# Altium project COB with RK3399.PrjPcb (part 1 of 5)
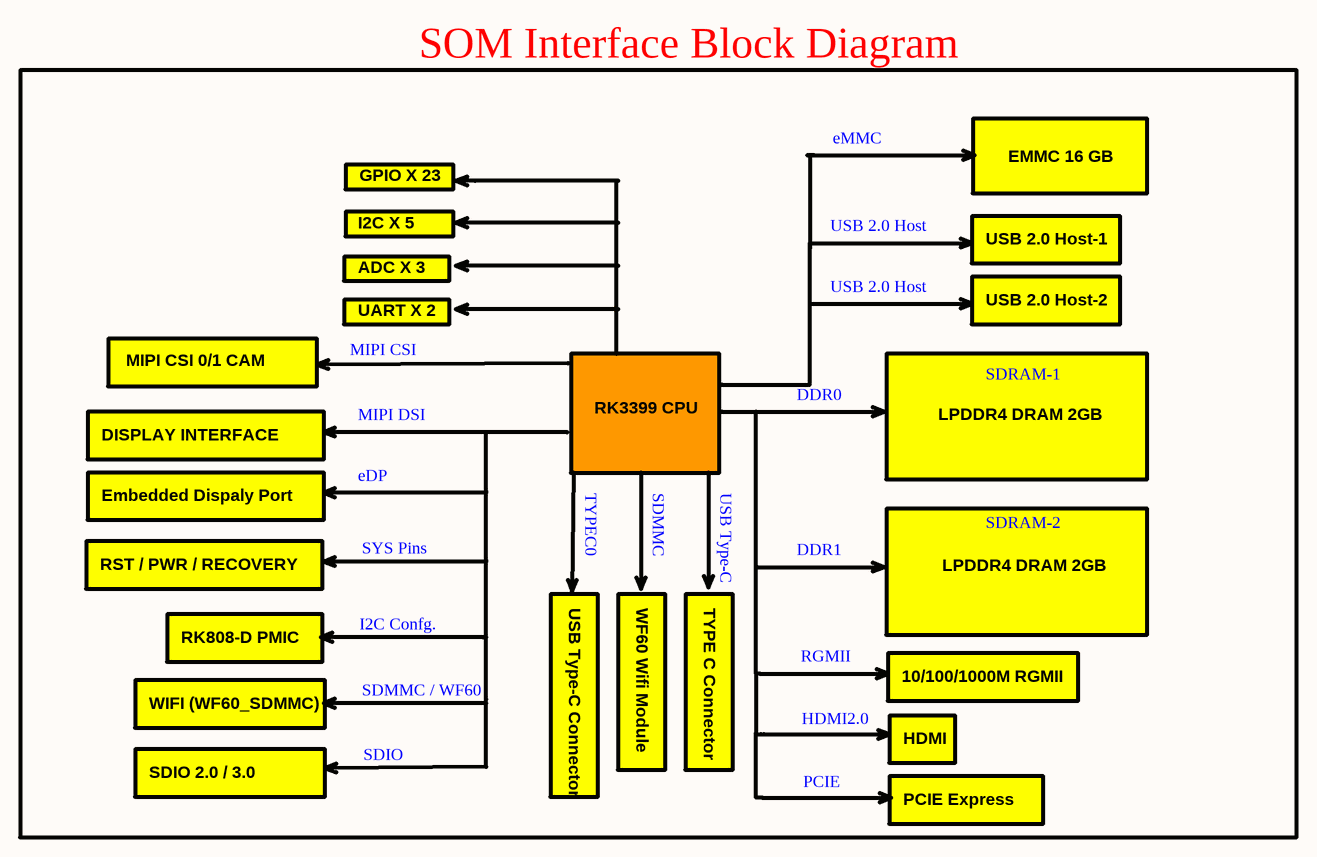
[diagram p0: Block Representation of COB.SchDoc]
27 sheets, 719 parts. Net scope: global (net labels, ports and power ports of the same name join across sheets).
Board file: COB with RK3399.PcbDoc
Sheets:
  Block Representation of COB.SchDoc
  Power Supply Page for RK3399.SchDoc
  System PMU for RK3399.SchDoc
  RK3399 Side of LPDDR4 Controller.SchDoc
  LPDDR4 SDRAM_1.SchDoc
  LPDDR4 SDRAM_2.SchDoc
  SDMMC EMMC PCIE ADC Blocks.SchDoc
  HDMI_MIPI-DSI_EDP.SchDoc
  TYPEC_USB2.0.SchDoc
  I2C_GPIOs_MIPI-CSI.SchDoc
  RGMII_SDIO_I2S.SchDoc
  PMIC_Block.SchDoc
  EMMC with RK3399.SchDoc
  WIFI Module Page.SchDoc
  Regulators and Buck Converters.SchDoc
  Power Supply for CPU Blocks.SchDoc
  RGMII ETH PHY.SchDoc
  RJ45 Connector and ESD Diodes.SchDoc
  HDMI Connector for RK3399.SchDoc
  TYPEC0 Connector.SchDoc
  USB2.0 Host Connectors.SchDoc
  MIPI CSI 0 and 1 Connectors.SchDoc
  EDP and MIPI DSI Connectors.SchDoc
  CODEC and Headphone Jack.SchDoc
  SD Card and Debug Uart.SchDoc
  40 Pin BS, FAN Connector and Test LEDs.SchDoc
  PCIE Connector.SchDoc

## Sheet Block Representation of COB.SchDoc: RK3399 COB Design V1.0
size A3; Author: AVIRAL MISHRA; DocumentNumber: 1; SheetNumber: 1; SheetTotal: 27; PROJECT CODE: A_V1.0

### Notes on the sheet
- SOM Interface Block Diagram
- eMMC
- EMMC 16 GB
- I2C X 5
- GPIO X 23
- USB 2.0 Host
- ADC X 3
- USB 2.0 Host-1
- MIPI CSI 0/1 CAM
- MIPI CSI
- UART X 2
- USB 2.0 Host-2
- MIPI DSI
- RK3399 CPU
- DDR0
- LPDDR4 DRAM 2GB
- SDRAM-1
- DISPLAY INTERFACE
- Embedded Dispaly Port
- eDP
- TYPEC0
- SDMMC
- USB Type-C
- SYS Pins
- DDR1
- SDRAM-2
- RST / PWR / RECOVERY
- I2C Confg.
- USB Type-C Connector
- WF60 Wifi Module
- TYPE C Connector
- RK808-D PMIC
- SDMMC / WF60
- RGMII
- 10/100/1000M RGMII
- WIFI (WF60_SDMMC)
- SDIO
- HDMI2.0
- HDMI
- SDIO 2.0 / 3.0
- PCIE
- PCIE Express
- TITLE:
- DOCUMENT NAME:
- SCALE 1:1
- This document is copyright of EsteemPCB and shall not be revealed, produced, copied, in whole or in part, nor
- PROJECT CODE:
- TEMPLATE:
- A4
- AUTHOR:
- Sheet
- of
- used for any purpose other than submitted.

## Sheet Power Supply Page for RK3399.SchDoc: RK3399 COB Design V1.0
size A3; Author: ABC; Organization: Altium Limited; Address1: L3, 12a Rodborough Rd; Address2: Frenchs Forest; Address3: NSW; Address4: Australia 2086; DocumentNumber: 2; SheetNumber: 2; SheetTotal: 27; PROJECT CODE: A_V1.0
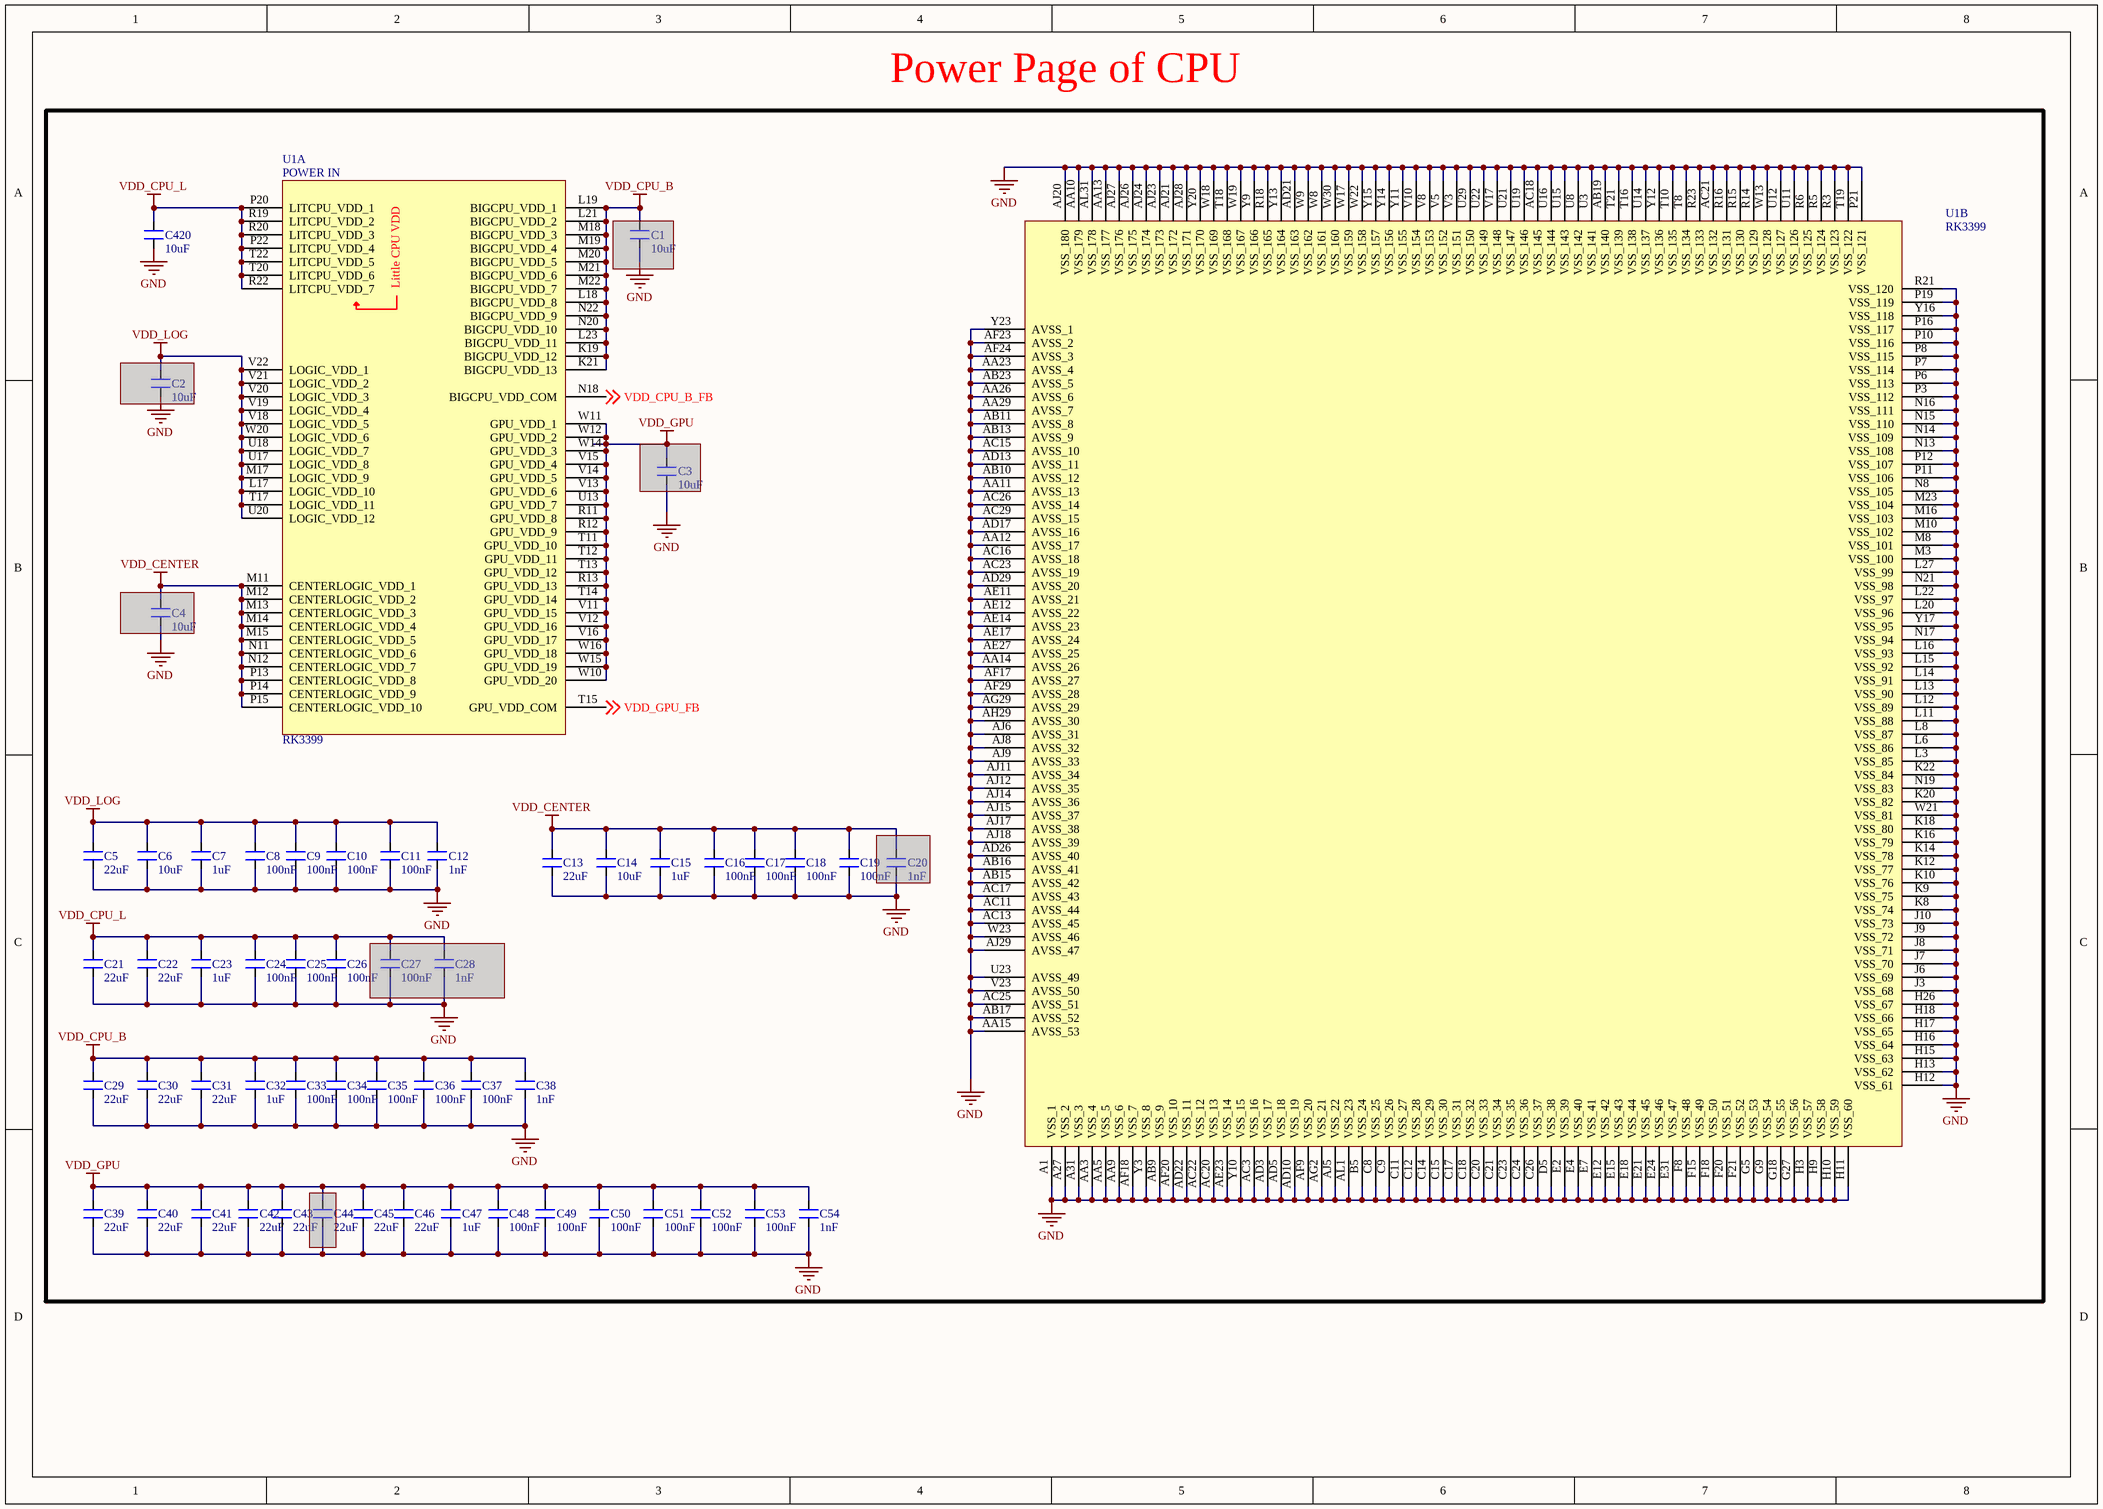
[diagram p1: Power Supply Page for RK3399.SchDoc]

### Parts
C1  10uF  [CAP_0402]  (masked out: inside a compile mask, not in the netlist)
C2  10uF  [CAP_0402]  (masked out: inside a compile mask, not in the netlist)
C3  10uF  [CAP_0402]  (masked out: inside a compile mask, not in the netlist)
C4  10uF  [CAP_0402]  (masked out: inside a compile mask, not in the netlist)
C5  22uF  [CAP_0402]
C6  10uF  [CAP_0402]
C7  1uF  [CAP_0201]
C8  100nF  [CAP_0201]
C9  100nF  [CAP_0201]
C10  100nF  [CAP_0201]
C11  100nF  [CAP_0201]
C12  1nF  [CAP_0201]
C13  22uF  [CAP_0402]
C14  10uF  [CAP_0402]
C15  1uF  [CAP_0201]
C16  100nF  [CAP_0201]
C17  100nF  [CAP_0201]
C18  100nF  [CAP_0201]
C19  100nF  [CAP_0201]
C20  1nF  [CAP_0201]  (masked out: inside a compile mask, not in the netlist)
C21  22uF  [CAP_0402]
C22  22uF  [CAP_0402]
C23  1uF  [CAP_0201]
C24  100nF  [CAP_0201]
C25  100nF  [CAP_0201]
C26  100nF  [CAP_0201]
C27  100nF  [CAP_0201]  (masked out: inside a compile mask, not in the netlist)
C28  1nF  [CAP_0201]  (masked out: inside a compile mask, not in the netlist)
C29  22uF  [CAP_0402]
C30  22uF  [CAP_0402]
C31  22uF  [CAP_0402]
C32  1uF  [CAP_0201]
C33  100nF  [CAP_0201]
C34  100nF  [CAP_0201]
C35  100nF  [CAP_0201]
C36  100nF  [CAP_0201]
C37  100nF  [CAP_0201]
C38  1nF  [CAP_0201]
C39  22uF  [CAP_0402]
C40  22uF  [CAP_0402]
C41  22uF  [CAP_0402]
C42  22uF  [CAP_0402]
C43  22uF  [CAP_0402]
C44  22uF  [CAP_0402]  (masked out: inside a compile mask, not in the netlist)
C45  22uF  [CAP_0402]
C46  22uF  [CAP_0402]
C47  1uF  [CAP_0201]
C48  100nF  [CAP_0201]
C49  100nF  [CAP_0201]
C50  100nF  [CAP_0201]
C51  100nF  [CAP_0201]
C52  100nF  [CAP_0201]
C53  100nF  [CAP_0201]
C54  1nF  [CAP_0201]
C420  10uF  [CAP_0402]
U1  RK3399  [FBGA828_23_826X826]  (parts A,B of 24)

### Blocks framed on the sheet
Power Page of CPU: C1-C54 C420 U1

### Nets
GND: C5.1 C6.1 C7.1 C8.1 C9.1 C10.1 C11.1 C12.1 C13.1 C14.1 C15.1 C16.1 C17.1 C18.1 C19.1 C21.1 C22.1 C23.1 C24.1 C25.1 C26.1 C29.1 C30.1 C31.1 C32.1 C33.1 C34.1 C35.1 C36.1 C37.1 C38.1 C39.1 C40.1 C41.1 C42.1 C43.1 C45.1 C46.1 C47.1 C48.1 C49.1 C50.1 C51.1 C52.1 C53.1 C54.1 C420.1 U1.A1(VSS_1) U1.A27(VSS_2) U1.A31(VSS_3) U1.AA3(VSS_4) U1.AA5(VSS_5) U1.AA9(VSS_6) U1.AA10(VSS_179) U1.AA11(AVSS_13) U1.AA12(AVSS_17) U1.AA13(VSS_177) U1.AA14(AVSS_26) U1.AA15(AVSS_53) U1.AA23(AVSS_4) U1.AA26(AVSS_6) U1.AA29(AVSS_7) U1.AB9(VSS_9) U1.AB10(AVSS_12) U1.AB11(AVSS_8) U1.AB13(AVSS_9) U1.AB15(AVSS_42) U1.AB16(AVSS_41) U1.AB17(AVSS_52) U1.AB19(VSS_140) U1.AB23(AVSS_5) U1.AC3(VSS_16) U1.AC11(AVSS_44) U1.AC13(AVSS_45) U1.AC15(AVSS_10) U1.AC16(AVSS_18) U1.AC17(AVSS_43) U1.AC18(VSS_145) U1.AC20(VSS_13) U1.AC21(VSS_132) U1.AC22(VSS_12) U1.AC23(AVSS_19) U1.AC25(AVSS_51) U1.AC26(AVSS_14) U1.AC29(AVSS_15) U1.AD3(VSS_17) U1.AD5(VSS_18) U1.AD10(VSS_19) U1.AD13(AVSS_11) U1.AD17(AVSS_16) U1.AD21(VSS_163) U1.AD22(VSS_11) U1.AD26(AVSS_40) U1.AD29(AVSS_20) U1.AE11(AVSS_21) U1.AE12(AVSS_22) U1.AE14(AVSS_23) U1.AE17(AVSS_24) U1.AE23(VSS_14) U1.AE27(AVSS_25) U1.AF9(VSS_20) U1.AF17(AVSS_27) U1.AF18(VSS_7) U1.AF20(VSS_10) U1.AF23(AVSS_2) U1.AF24(AVSS_3) U1.AF29(AVSS_28) U1.AG2(VSS_21) U1.AG29(AVSS_29) U1.AH29(AVSS_30) U1.AJ5(VSS_22) U1.AJ6(AVSS_31) U1.AJ8(AVSS_32) U1.AJ9(AVSS_33) U1.AJ11(AVSS_34) U1.AJ12(AVSS_35) U1.AJ14(AVSS_36) U1.AJ15(AVSS_37) U1.AJ17(AVSS_38) U1.AJ18(AVSS_39) U1.AJ20(VSS_180) U1.AJ21(VSS_172) U1.AJ23(VSS_173) U1.AJ24(VSS_174) U1.AJ26(VSS_175) U1.AJ27(VSS_176) U1.AJ28(VSS_171) U1.AJ29(AVSS_47) U1.AL1(VSS_23) U1.AL31(VSS_178) U1.B5(VSS_24) U1.C8(VSS_25) U1.C9(VSS_26) U1.C11(VSS_27) U1.C12(VSS_28) U1.C14(VSS_29) U1.C15(VSS_30) U1.C17(VSS_31) U1.C18(VSS_32) U1.C20(VSS_33) U1.C21(VSS_34) U1.C23(VSS_35) U1.C24(VSS_36) U1.C26(VSS_37) U1.D5(VSS_38) U1.E2(VSS_39) U1.E4(VSS_40) U1.E7(VSS_41) U1.E12(VSS_42) U1.E15(VSS_43) U1.E18(VSS_44) U1.E21(VSS_45) U1.E24(VSS_46) U1.E31(VSS_47) U1.F8(VSS_48) U1.F15(VSS_49) U1.F18(VSS_50) U1.F20(VSS_51) U1.F21(VSS_52) U1.G5(VSS_53) U1.G9(VSS_54) U1.G18(VSS_55) U1.G27(VSS_56) U1.H3(VSS_57) U1.H9(VSS_58) U1.H10(VSS_59) U1.H11(VSS_60) U1.H12(VSS_61) U1.H13(VSS_62) U1.H15(VSS_63) U1.H16(VSS_64) U1.H17(VSS_65) U1.H18(VSS_66) U1.H26(VSS_67) U1.J3(VSS_68) U1.J6(VSS_69) U1.J7(VSS_70) U1.J8(VSS_71) U1.J9(VSS_72) U1.J10(VSS_73) U1.K8(VSS_74) U1.K9(VSS_75) U1.K10(VSS_76) U1.K12(VSS_77) U1.K14(VSS_78) U1.K16(VSS_79) U1.K18(VSS_80) U1.K20(VSS_82) U1.K22(VSS_84) U1.L3(VSS_85) U1.L6(VSS_86) U1.L8(VSS_87) U1.L11(VSS_88) U1.L12(VSS_89) U1.L13(VSS_90) U1.L14(VSS_91) U1.L15(VSS_92) U1.L16(VSS_93) U1.L20(VSS_96) U1.L22(VSS_97) U1.L27(VSS_99) U1.M3(VSS_100) U1.M8(VSS_101) U1.M10(VSS_102) U1.M16(VSS_103) U1.M23(VSS_104) U1.N8(VSS_105) U1.N13(VSS_108) U1.N14(VSS_109) U1.N15(VSS_110) U1.N16(VSS_111) U1.N17(VSS_94) U1.N19(VSS_83) U1.N21(VSS_98) U1.P3(VSS_112) U1.P6(VSS_113) U1.P7(VSS_114) U1.P8(VSS_115) U1.P10(VSS_116) U1.P11(VSS_106) U1.P12(VSS_107) U1.P16(VSS_117) U1.P19(VSS_119) U1.P21(VSS_121) U1.R3(VSS_123) U1.R5(VSS_124) U1.R6(VSS_125) U1.R14(VSS_129) U1.R15(VSS_130) U1.R16(VSS_131) U1.R18(VSS_165) U1.R21(VSS_120) U1.R23(VSS_133) U1.T8(VSS_134) U1.T10(VSS_135) U1.T16(VSS_138) U1.T18(VSS_168) U1.T19(VSS_122) U1.T21(VSS_139) U1.U3(VSS_141) U1.U8(VSS_142) U1.U11(VSS_126) U1.U12(VSS_127) U1.U14(VSS_137) U1.U15(VSS_143) U1.U16(VSS_144) U1.U19(VSS_146) U1.U21(VSS_147) U1.U22(VSS_149) U1.U23(AVSS_49) U1.U29(VSS_150) U1.V3(VSS_151) U1.V5(VSS_152) U1.V8(VSS_153) U1.V10(VSS_154) U1.V17(VSS_148) U1.V23(AVSS_50) U1.W8(VSS_161) U1.W9(VSS_162) U1.W13(VSS_128) U1.W17(VSS_159) U1.W18(VSS_169) U1.W19(VSS_167) U1.W21(VSS_81) U1.W22(VSS_158) U1.W23(AVSS_46) U1.W30(VSS_160) U1.Y3(VSS_8) U1.Y9(VSS_166) U1.Y10(VSS_15) U1.Y11(VSS_155) U1.Y12(VSS_136) U1.Y13(VSS_164) U1.Y14(VSS_156) U1.Y15(VSS_157) U1.Y16(VSS_118) U1.Y17(VSS_95) U1.Y20(VSS_170) U1.Y23(AVSS_1)
VDD_CENTER: C13.2 C14.2 C15.2 C16.2 C17.2 C18.2 C19.2 U1.M11(CENTERLOGIC_VDD_1) U1.M12(CENTERLOGIC_VDD_2) U1.M13(CENTERLOGIC_VDD_3) U1.M14(CENTERLOGIC_VDD_4) U1.M15(CENTERLOGIC_VDD_5) U1.N11(CENTERLOGIC_VDD_6) U1.N12(CENTERLOGIC_VDD_7) U1.P13(CENTERLOGIC_VDD_8) U1.P14(CENTERLOGIC_VDD_9) U1.P15(CENTERLOGIC_VDD_10)
VDD_CPU_B: C29.2 C30.2 C31.2 C32.2 C33.2 C34.2 C35.2 C36.2 C37.2 C38.2 U1.K19(BIGCPU_VDD_12) U1.K21(BIGCPU_VDD_13) U1.L18(BIGCPU_VDD_8) U1.L19(BIGCPU_VDD_1) U1.L21(BIGCPU_VDD_2) U1.L23(BIGCPU_VDD_11) U1.M18(BIGCPU_VDD_3) U1.M19(BIGCPU_VDD_4) U1.M20(BIGCPU_VDD_5) U1.M21(BIGCPU_VDD_6) U1.M22(BIGCPU_VDD_7) U1.N20(BIGCPU_VDD_10) U1.N22(BIGCPU_VDD_9)
VDD_CPU_L: C21.2 C22.2 C23.2 C24.2 C25.2 C26.2 C420.2 U1.P20(LITCPU_VDD_1) U1.P22(LITCPU_VDD_4) U1.R19(LITCPU_VDD_2) U1.R20(LITCPU_VDD_3) U1.R22(LITCPU_VDD_7) U1.T20(LITCPU_VDD_6) U1.T22(LITCPU_VDD_5)
VDD_GPU: C39.2 C40.2 C41.2 C42.2 C43.2 C45.2 C46.2 C47.2 C48.2 C49.2 C50.2 C51.2 C52.2 C53.2 C54.2
VDD_LOG: C5.2 C6.2 C7.2 C8.2 C9.2 C10.2 C11.2 C12.2 U1.L17(LOGIC_VDD_10) U1.M17(LOGIC_VDD_9) U1.T17(LOGIC_VDD_11) U1.U17(LOGIC_VDD_8) U1.U18(LOGIC_VDD_7) U1.U20(LOGIC_VDD_12) U1.V18(LOGIC_VDD_5) U1.V19(LOGIC_VDD_4) U1.V20(LOGIC_VDD_3) U1.V21(LOGIC_VDD_2) U1.V22(LOGIC_VDD_1) U1.W20(LOGIC_VDD_6)
VDD_CPU_B_FB: U1.N18(BIGCPU_VDD_COM) ; off-sheet VDD_CPU_B_FB
VDD_GPU_FB: U1.T15(GPU_VDD_COM) ; off-sheet VDD_GPU_FB
NetU1_R11: U1.R11(GPU_VDD_8) U1.R12(GPU_VDD_9) U1.R13(GPU_VDD_13) U1.T11(GPU_VDD_10) U1.T12(GPU_VDD_11) U1.T13(GPU_VDD_12) U1.T14(GPU_VDD_14) U1.U13(GPU_VDD_7) U1.V11(GPU_VDD_15) U1.V12(GPU_VDD_16) U1.V13(GPU_VDD_6) U1.V14(GPU_VDD_5) U1.V15(GPU_VDD_4) U1.V16(GPU_VDD_17) U1.W10(GPU_VDD_20) U1.W11(GPU_VDD_1) U1.W12(GPU_VDD_2) U1.W14(GPU_VDD_3) U1.W15(GPU_VDD_19) U1.W16(GPU_VDD_18)

### Notes on the sheet
- TITLE:
- DOCUMENT NAME:
- SCALE 1:1
- This document is copyright of Esteempcb and shall not be revealed, produced, copied, in whole or in part, nor
- PROJECT CODE:
- TEMPLATE:
- A3
- AUTHOR:
- Sheet
- of
- used for any purpose other than submitted.
- (in symbol IC_RK3399-FCBGA828, part A) POWER IN; Little CPU VDD

### Library data of the parts
C1-C4 C6 C14 C420 = CAP_10uF-10V-20%-0402: 10µF ±20% 10V Ceramic Capacitor X5R 0402 (1005 Metric) /; Manufacturer Part Number: CL05A106MP5NUNC; Manufacturer: Samsung Electro-Mechanics; Case/Package: 0402; Supplier-1: Digikey
C5 C13 C21 C22 C29-C31 C39-C46 = CAP_22uF-6.3V-20%-0402: 22µF ±20% 6.3V Ceramic Capacitor X5R 0402 (1005 Metric) /; Manufacturer: Murata Electronics; Manufacturer Part Number: CL05A226MQ5N6J8; Case/Package: 0402; Supplier-1: Digikey
C7 C15 C23 C32 C47 = CAP_1uF-16V-10%-0201: 1µF ±20% 16V Ceramic Capacitor X5R 0201 (0603 Metric) /; Manufacturer: Samsung Electro-Mechanics; Manufacturer Part Number: CL03A105MO3NRNH; Case/Package: 0201; Supplier-1: Digikey
C8-C11 C16-C19 C24-C27 C33-C37 C48-C53 = CAP_100nF-25V-10%-0201: 0.1µF ±10% 25V Ceramic Capacitor X5R 0201 (0603 Metric) /; Manufacturer: TDK Corporation; Manufacturer Part Number: C0603X5R1E104K030BB; Case/Package: 0201; Supplier-1: Digikey
C12 C20 C28 C38 C54 = CAP_1nF-16V-10%-0201: 1000pF ±10% 16V Ceramic Capacitor X7R 0201 (0603 Metric) /; Manufacturer: Murata Electronics; Manufacturer Part Number: GRM033R71C102KA01D; Case/Package: 0201; Supplier-1: Digikey
U1 = IC_RK3399-FCBGA828: RK3399 is a low power, high performance processor for computing, personal mobile.; Manufacturer: Rockchip; Manufacturer Part Number: RK3399; Case/Package: FCBGA828; Supplier-1: Rockchip

## Sheet System PMU for RK3399.SchDoc: RK3399 COB Design V1.0
size A3; Author: AVIRAL MISHRA; DocumentNumber: 3; SheetNumber: 3; SheetTotal: 27; PROJECT CODE: A_V1.0
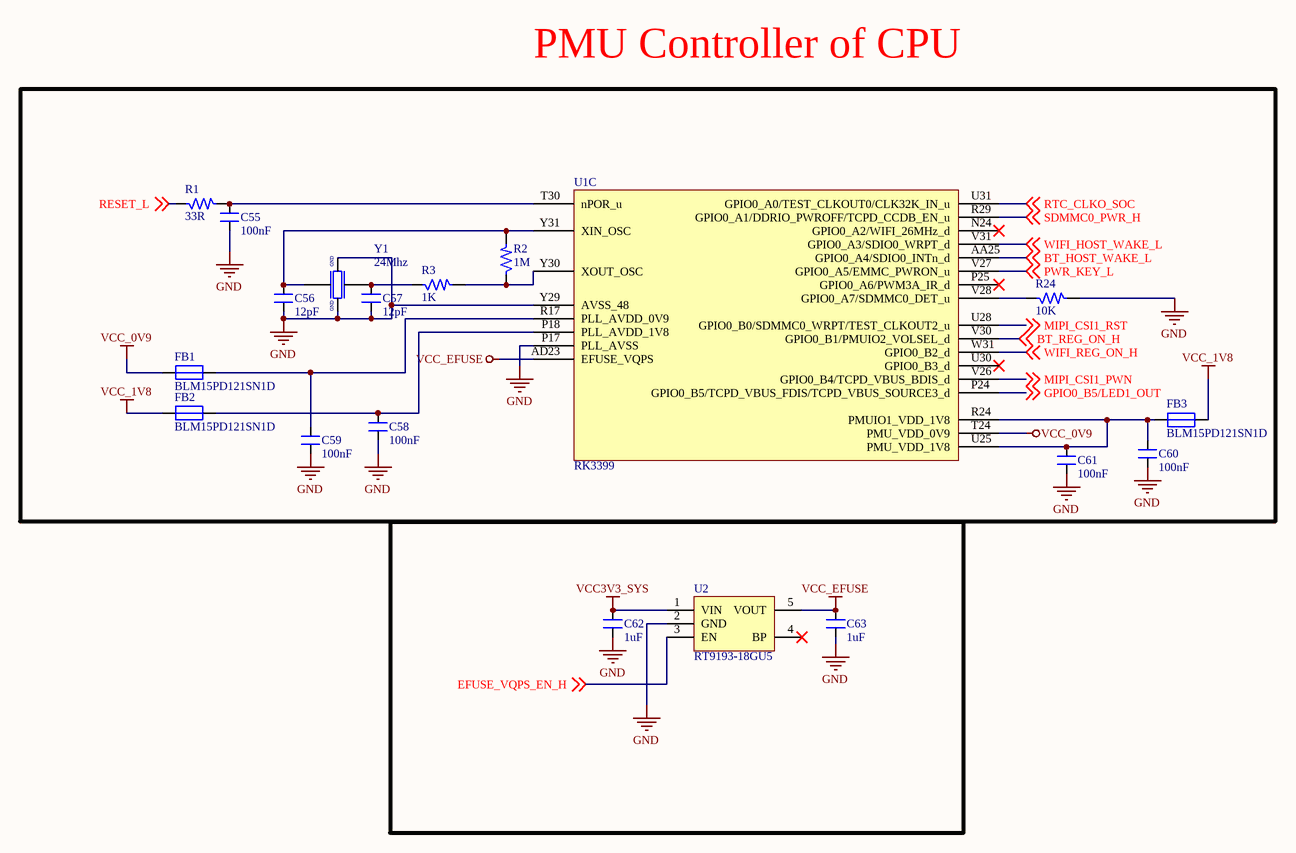
[diagram p2: System PMU for RK3399.SchDoc]

### Parts
C55  100nF  [CAP_0201]
C56  12pF  [CAP_0201]
C57  12pF  [CAP_0201]
C58  100nF  [CAP_0201]
C59  100nF  [CAP_0201]
C60  100nF  [CAP_0201]
C61  100nF  [CAP_0201]
C62  1uF  [CAP_0201]
C63  1uF  [CAP_0201]
FB1  BLM15PD121SN1D  [RES_0402]
FB2  BLM15PD121SN1D  [RES_0402]
FB3  BLM15PD121SN1D  [RES_0402]
R1  33R  [RES_0201]
R2  1M  [RES_0201]
R3  1K  [RES_0201]
R24  10K  [RES_0201]
U1  RK3399  [FBGA828_23_826X826]  (part C of 24)
U2  RT9193-18GU5  [SC70-5]
Y1  24Mhz  [XTAL_ABM8AIG-24.000MHZ-12-2Z-T3]

### Nets
GND: C55.1 C56.1 C57.1 C58.1 C59.1 C60.1 C61.1 C62.1 C63.1 R24.2 U1.P17(PLL_AVSS) U1.Y29(AVSS_48) U2.2(GND) Y1.2 Y1.4
VCC3V3_SYS: C62.2 U2.1(VIN)
VCC_0V9: FB1.1 U1.T24(PMU_VDD_0V9)
VCC_1V8: FB2.1 FB3.2
VCC_EFUSE: C63.2 U1.AD23(EFUSE_VQPS) U2.5(VOUT)
BT_HOST_WAKE_L: U1.AA25(GPIO0_A4/SDIO0_INTn_d) ; off-sheet BT_HOST_WAKE_L
BT_REG_ON_H: U1.V30(GPIO0_B1/PMUIO2_VOLSEL_d) ; off-sheet BT_REG_ON_H
EFUSE_VQPS_EN_H: U2.3(EN) ; off-sheet EFUSE_VQPS_EN_H
GPIO0_B5/LED1_OUT: U1.P24(GPIO0_B5/TCPD_VBUS_FDIS/TCPD_VBUS_SOURCE3_d) ; off-sheet GPIO0_B5/LED1_OUT
MIPI_CSI1_PWN: U1.V26(GPIO0_B4/TCPD_VBUS_BDIS_d) ; off-sheet MIPI_CSI1_PWN
MIPI_CSI1_RST: U1.U28(GPIO0_B0/SDMMC0_WRPT/TEST_CLKOUT2_u) ; off-sheet MIPI_CSI1_RST
PWR_KEY_L: U1.V27(GPIO0_A5/EMMC_PWRON_u) ; off-sheet PWR_KEY_L
RESET_L: R1.1 ; off-sheet RESET_L
RTC_CLKO_SOC: U1.U31(GPIO0_A0/TEST_CLKOUT0/CLK32K_IN_u) ; off-sheet RTC_CLKO_SOC
SDMMC0_PWR_H: U1.R29(GPIO0_A1/DDRIO_PWROFF/TCPD_CCDB_EN_u) ; off-sheet SDMMC0_PWR_H
WIFI_HOST_WAKE_L: U1.V31(GPIO0_A3/SDIO0_WRPT_d) ; off-sheet WIFI_HOST_WAKE_L
WIFI_REG_ON_H: U1.W31(GPIO0_B2_d) ; off-sheet WIFI_REG_ON_H
NetC55_2: C55.2 R1.2 U1.T30(nPOR_u)
NetC56_2: C56.2 R2.2 U1.Y31(XIN_OSC) Y1.1
NetC57_2: C57.2 R3.1 Y1.3
NetC58_2: C58.2 FB2.2 U1.P18(PLL_AVDD_1V8)
NetC59_2: C59.2 FB1.2 U1.R17(PLL_AVDD_0V9)
NetC60_2: C60.2 C61.2 FB3.1 U1.R24(PMUIO1_VDD_1V8) U1.U25(PMU_VDD_1V8)
NetR2_1: R2.1 R3.2 U1.Y30(XOUT_OSC)
NetR24_1: R24.1 U1.V28(GPIO0_A7/SDMMC0_DET_u)

Not connected (* = marked no-connect by the designer): U1 N24(GPIO0_A2/WIFI_26MHz_d)* P25(GPIO0_A6/PWM3A_IR_d)* U30(GPIO0_B3_d)*; U2 4(BP)*

### Notes on the sheet
- PMU Controller of CPU
- TITLE:
- DOCUMENT NAME:
- SCALE 1:1
- This document is copyright of EsteemPCB and shall not be revealed, produced, copied, in whole or in part, nor
- PROJECT CODE:
- TEMPLATE:
- A4
- AUTHOR:
- Sheet
- of
- used for any purpose other than submitted.
- (in symbol XTAL_24Mhz-12pF-4-SMD) GND

### Library data of the parts
C55 C58-C61 = CAP_100nF-25V-10%-0201: as C8 on sheet Power Supply Page for RK3399; Case/Package: 0201; Supplier-1: Digikey
C56 C57 = CAP_12pF-16V-10%-0201: 12pF ±10% 16V Ceramic Capacitor C0G, NP0 0201 (0603 Metric) /; Manufacturer: AVX Corporation; Manufacturer Part Number: 0201YA120KAT2A; Case/Package: 0201; Supplier-1: Digikey
C62 C63 = CAP_1uF-16V-10%-0201: as C7 on sheet Power Supply Page for RK3399; Case/Package: 0201; Supplier-1: Digikey
FB1-FB3 = FB_120R-1.3A-100Mhz-0402: 120 Ohms @ 100MHz 1 Power Line Ferrite Bead 0402 (1005 Metric) 1.3A 90mOhm; Manufacturer: Murata Electronics; Mnaufacturer Part Number: BLM15PD121SN1D; Case/Package: 0402; Supplier-1: Digikey
R1 = RES_33R-0.05W-1%-0201: 33 Ohms ±1% 0.05W, 1/20W Chip Resistor 0201 (0603 Metric) Thick Film /; Manufacturer: Yageo; Manufacturer Part Number: RC0201FR-0733RL; Case/Package: 0201; Supplier-1: Digikey
R2 = RES_1M-0.05W-1%-0201: 1 MOhms ±1% 0.05W, 1/20W Chip Resistor 0201 (0603 Metric) Thick Film /; Manufacturer: Yageo; Manufacturer Part Number: RC0201FR-071ML; Case/Package: 0201; Supplier-1: Digikey
R3 = RES_1K-0.05W-1%-0201: 1 kOhms ±1% 0.05W, 1/20W Chip Resistor 0201 (0603 Metric) Thick Film /; Manufacturer: Yageo; Manufacturer Part Number: RC0201FR-071KL; Case/Package: 0201; Supplier-1: Digikey
R24 = RES_10K-0.05W-1%-0201: 10 kOhms ±1% 0.05W, 1/20W Chip Resistor 0201 (0603 Metric) Thick Film /; Manufacturer: Stackpole Electronics Inc; Manufacturer Part Number: RMCF0201FT10K0; Case/Package: 0201; Supplier-1: Digikey
U1 = IC_RK3399-FCBGA828: as U1 on sheet Power Supply Page for RK3399; Manufacturer Part Number: RK3399; Case/Package: FCBGA828; Supplier-1: Rockchip
U2 = REG_1.8V-300mA-5.5V-SC70-5: Linear Voltage Regulator IC 1 Output 300mA SC-70-5; Manufacturer: Richtek USA Inc.; Manufacturer Part Number: RT9193-18GU5; Case/Package: SC70-5; Supplier-1: Digikey
Y1 = XTAL_24Mhz-12pF-4-SMD: 24MHz ±20ppm Crystal 12pF 50 Ohms 4-SMD, No Lead /; Manufacturer: Abracon LLC; Manufacturer Part Number: ABM8AIG-24.000MHZ-12-2Z-T3; Case/Package: SMD; Supplier-1: Digikey

## Sheet RK3399 Side of LPDDR4 Controller.SchDoc: RK3399 COB Design V1.0
size A3; Author: ABC; Organization: Altium Limited; Address1: L3, 12a Rodborough Rd; Address2: Frenchs Forest; Address3: NSW; Address4: Australia 2086; DocumentNumber: 4; SheetNumber: 4; SheetTotal: 27; PROJECT CODE: A_V1.0
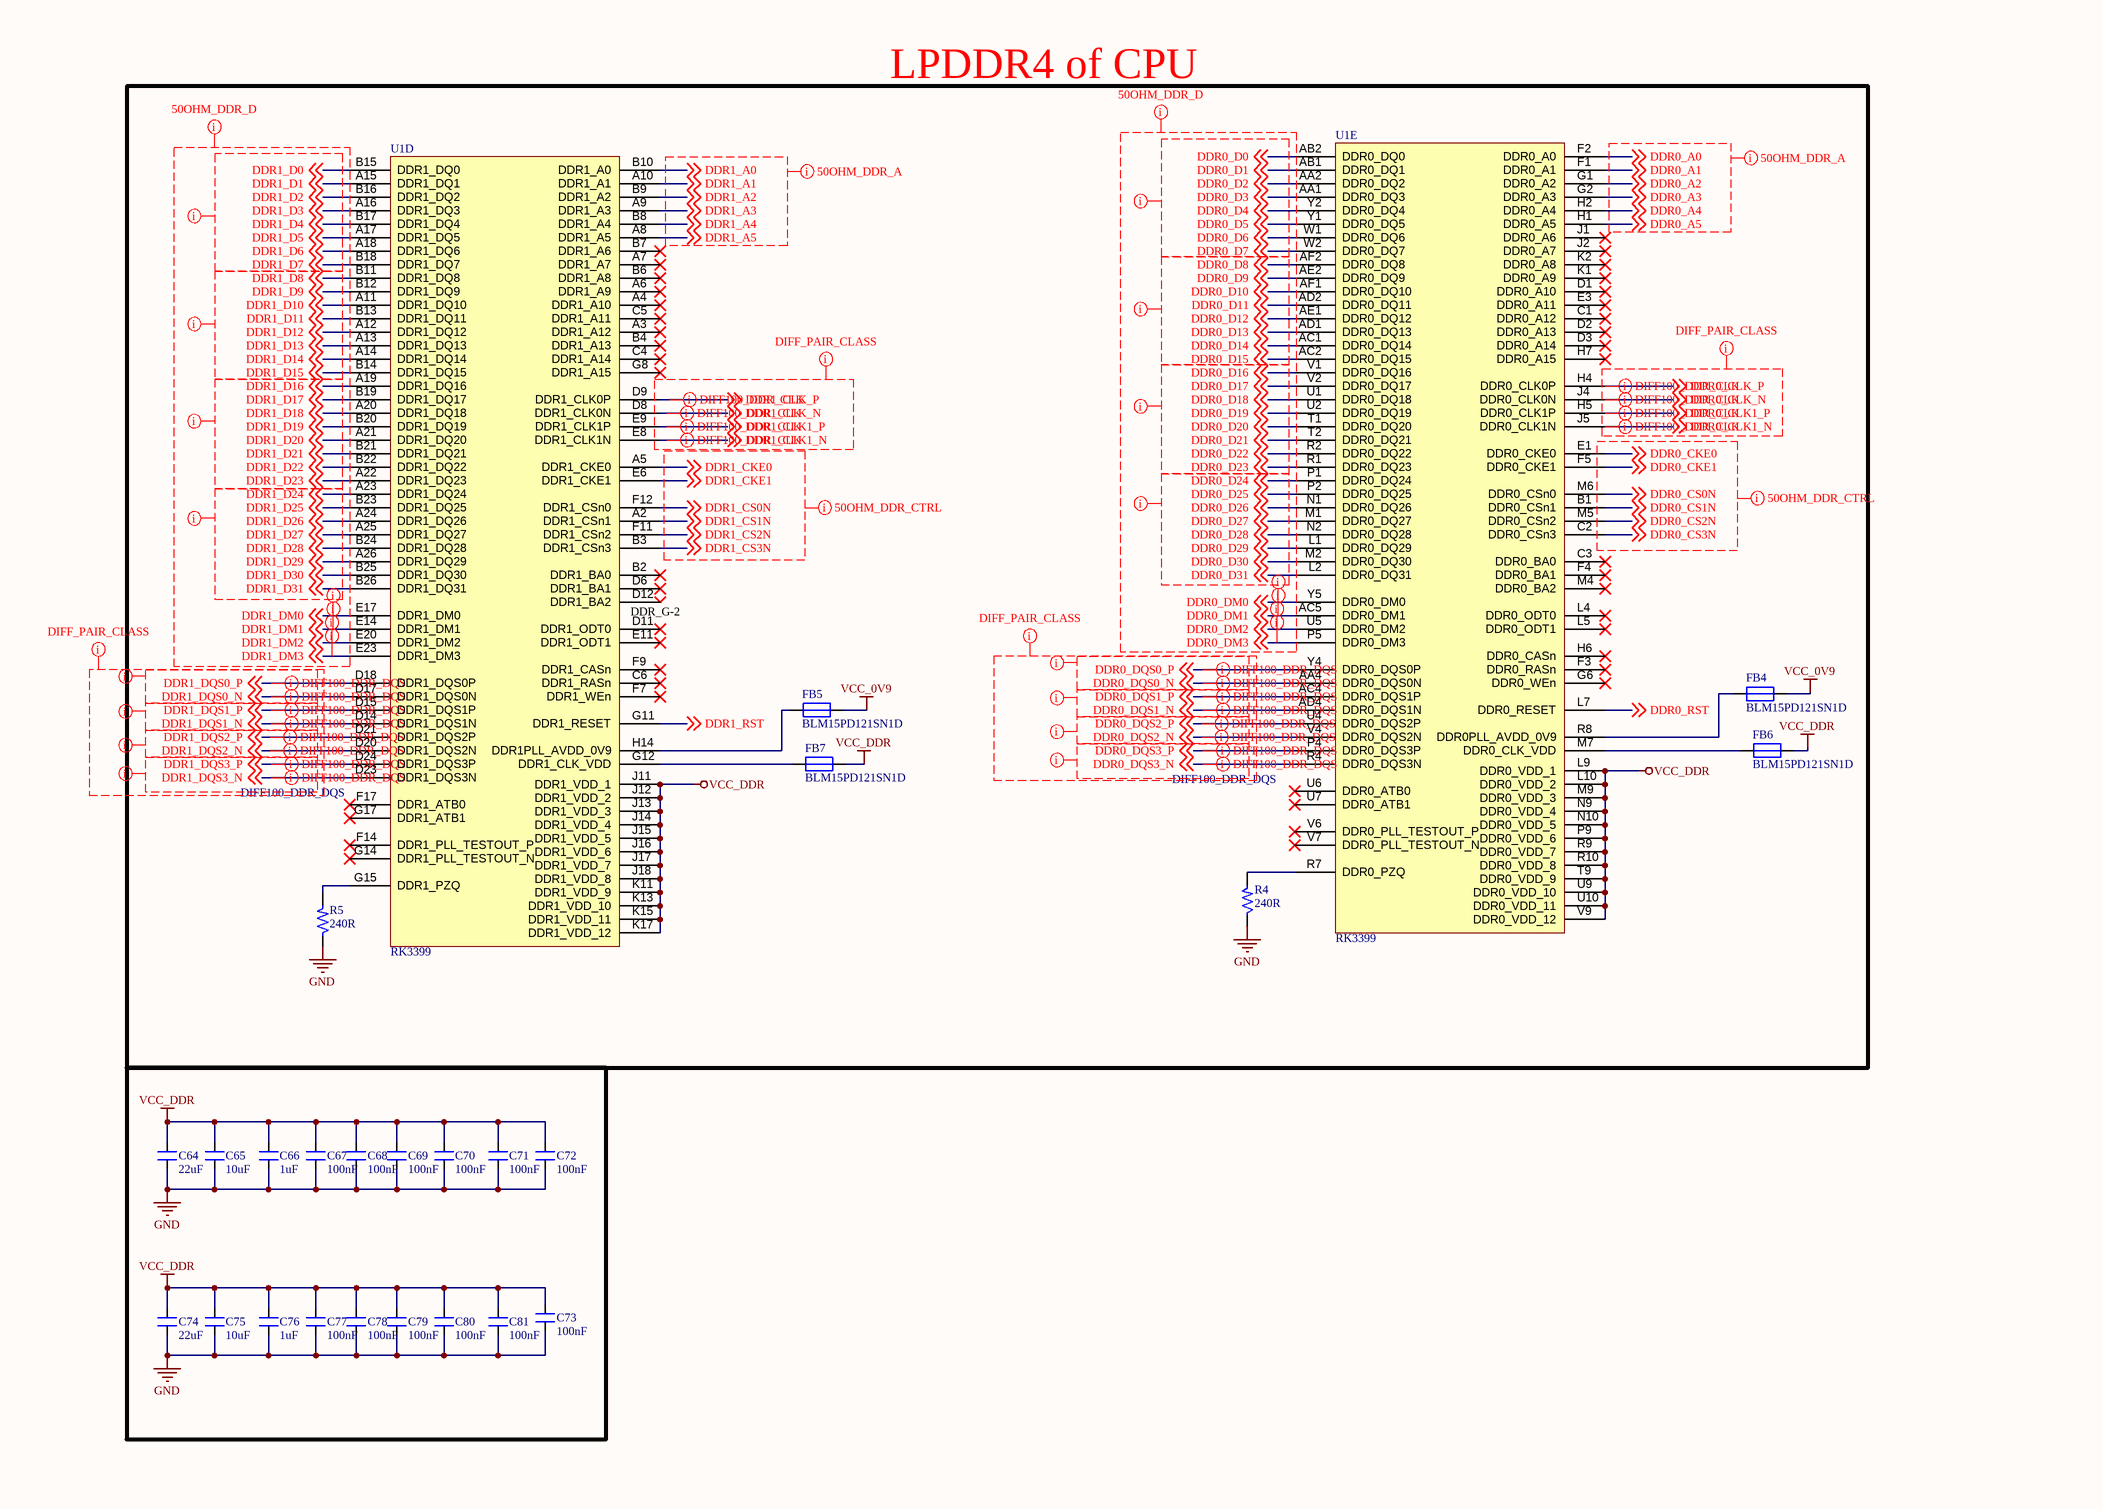
[diagram p3: RK3399 Side of LPDDR4 Controller.SchDoc]

### Parts
C64  22uF  [CAP_0402]
C65  10uF  [CAP_0402]
C66  1uF  [CAP_0201]
C67  100nF  [CAP_0201]
C68  100nF  [CAP_0201]
C69  100nF  [CAP_0201]
C70  100nF  [CAP_0201]
C71  100nF  [CAP_0201]
C72  100nF  [CAP_0201]
C73  100nF  [CAP_0201]
C74  22uF  [CAP_0402]
C75  10uF  [CAP_0402]
C76  1uF  [CAP_0201]
C77  100nF  [CAP_0201]
C78  100nF  [CAP_0201]
C79  100nF  [CAP_0201]
C80  100nF  [CAP_0201]
C81  100nF  [CAP_0201]
FB4  BLM15PD121SN1D  [RES_0402]
FB5  BLM15PD121SN1D  [RES_0402]
FB6  BLM15PD121SN1D  [RES_0402]
FB7  BLM15PD121SN1D  [RES_0402]
R4  240R  [RES_0201]
R5  240R  [RES_0201]
U1  RK3399  [FBGA828_23_826X826]  (parts D,E of 24)

### Blocks framed on the sheet
LPDDR4 of CPU: FB4-FB7 R4 R5 U1

### Nets
GND: C64.1 C65.1 C66.1 C67.1 C68.1 C69.1 C70.1 C71.1 C72.1 C73.1 C74.1 C75.1 C76.1 C77.1 C78.1 C79.1 C80.1 C81.1 R4.1 R5.1
VCC_0V9: FB4.2 FB5.2
VCC_DDR: C64.2 C65.2 C66.2 C67.2 C68.2 C69.2 C70.2 C71.2 C72.2 C73.2 C74.2 C75.2 C76.2 C77.2 C78.2 C79.2 C80.2 C81.2 FB6.2 FB7.2 U1.J11(DDR1_VDD_1) U1.J12(DDR1_VDD_2) U1.J13(DDR1_VDD_3) U1.J14(DDR1_VDD_4) U1.J15(DDR1_VDD_5) U1.J16(DDR1_VDD_6) U1.J17(DDR1_VDD_7) U1.J18(DDR1_VDD_8) U1.K11(DDR1_VDD_9) U1.K13(DDR1_VDD_10) U1.K15(DDR1_VDD_11) U1.K17(DDR1_VDD_12) U1.L9(DDR0_VDD_1) U1.L10(DDR0_VDD_2) U1.M9(DDR0_VDD_3) U1.N9(DDR0_VDD_4) U1.N10(DDR0_VDD_5) U1.P9(DDR0_VDD_6) U1.R9(DDR0_VDD_7) U1.R10(DDR0_VDD_8) U1.T9(DDR0_VDD_9) U1.U9(DDR0_VDD_10) U1.U10(DDR0_VDD_11) U1.V9(DDR0_VDD_12)
DDR0_A0: U1.F2(DDR0_A0) ; off-sheet DDR0_A0
DDR0_A1: U1.F1(DDR0_A1) ; off-sheet DDR0_A1
DDR0_A2: U1.G1(DDR0_A2) ; off-sheet DDR0_A2
DDR0_A3: U1.G2(DDR0_A3) ; off-sheet DDR0_A3
DDR0_A4: U1.H2(DDR0_A4) ; off-sheet DDR0_A4
DDR0_A5: U1.H1(DDR0_A5) ; off-sheet DDR0_A5
DDR0_CKE0: U1.E1(DDR0_CKE0) ; off-sheet DDR0_CKE0
DDR0_CKE1: U1.F5(DDR0_CKE1) ; off-sheet DDR0_CKE1
DDR0_CLK1_N: U1.J5(DDR0_CLK1N) ; off-sheet DDR0_CLK1_N
DDR0_CLK1_P: U1.H5(DDR0_CLK1P) ; off-sheet DDR0_CLK1_P
DDR0_CLK_N: U1.J4(DDR0_CLK0N) ; off-sheet DDR0_CLK_N
DDR0_CLK_P: U1.H4(DDR0_CLK0P) ; off-sheet DDR0_CLK_P
DDR0_CS0N: U1.M6(DDR0_CSn0) ; off-sheet DDR0_CS0N
DDR0_CS1N: U1.B1(DDR0_CSn1) ; off-sheet DDR0_CS1N
DDR0_CS2N: U1.M5(DDR0_CSn2) ; off-sheet DDR0_CS2N
DDR0_CS3N: U1.C2(DDR0_CSn3) ; off-sheet DDR0_CS3N
DDR0_D0: U1.AB2(DDR0_DQ0) ; off-sheet DDR0_D0
DDR0_D1: U1.AB1(DDR0_DQ1) ; off-sheet DDR0_D1
DDR0_D2: U1.AA2(DDR0_DQ2) ; off-sheet DDR0_D2
DDR0_D3: U1.AA1(DDR0_DQ3) ; off-sheet DDR0_D3
DDR0_D4: U1.Y2(DDR0_DQ4) ; off-sheet DDR0_D4
DDR0_D5: U1.Y1(DDR0_DQ5) ; off-sheet DDR0_D5
DDR0_D6: U1.W1(DDR0_DQ6) ; off-sheet DDR0_D6
DDR0_D7: U1.W2(DDR0_DQ7) ; off-sheet DDR0_D7
DDR0_D8: U1.AF2(DDR0_DQ8) ; off-sheet DDR0_D8
DDR0_D9: U1.AE2(DDR0_DQ9) ; off-sheet DDR0_D9
DDR0_D10: U1.AF1(DDR0_DQ10) ; off-sheet DDR0_D10
DDR0_D11: U1.AD2(DDR0_DQ11) ; off-sheet DDR0_D11
DDR0_D12: U1.AE1(DDR0_DQ12) ; off-sheet DDR0_D12
DDR0_D13: U1.AD1(DDR0_DQ13) ; off-sheet DDR0_D13
DDR0_D14: U1.AC1(DDR0_DQ14) ; off-sheet DDR0_D14
DDR0_D15: U1.AC2(DDR0_DQ15) ; off-sheet DDR0_D15
DDR0_D16: U1.V1(DDR0_DQ16) ; off-sheet DDR0_D16
DDR0_D17: U1.V2(DDR0_DQ17) ; off-sheet DDR0_D17
DDR0_D18: U1.U1(DDR0_DQ18) ; off-sheet DDR0_D18
DDR0_D19: U1.U2(DDR0_DQ19) ; off-sheet DDR0_D19
DDR0_D20: U1.T1(DDR0_DQ20) ; off-sheet DDR0_D20
DDR0_D21: U1.T2(DDR0_DQ21) ; off-sheet DDR0_D21
DDR0_D22: U1.R2(DDR0_DQ22) ; off-sheet DDR0_D22
DDR0_D23: U1.R1(DDR0_DQ23) ; off-sheet DDR0_D23
DDR0_D24: U1.P1(DDR0_DQ24) ; off-sheet DDR0_D24
DDR0_D25: U1.P2(DDR0_DQ25) ; off-sheet DDR0_D25
DDR0_D26: U1.N1(DDR0_DQ26) ; off-sheet DDR0_D26
DDR0_D27: U1.M1(DDR0_DQ27) ; off-sheet DDR0_D27
DDR0_D28: U1.N2(DDR0_DQ28) ; off-sheet DDR0_D28
DDR0_D29: U1.L1(DDR0_DQ29) ; off-sheet DDR0_D29
DDR0_D30: U1.M2(DDR0_DQ30) ; off-sheet DDR0_D30
DDR0_D31: U1.L2(DDR0_DQ31) ; off-sheet DDR0_D31
DDR0_DM0: U1.Y5(DDR0_DM0) ; off-sheet DDR0_DM0
DDR0_DM1: U1.AC5(DDR0_DM1) ; off-sheet DDR0_DM1
DDR0_DM2: U1.U5(DDR0_DM2) ; off-sheet DDR0_DM2
DDR0_DM3: U1.P5(DDR0_DM3) ; off-sheet DDR0_DM3
DDR0_DQS0_N: U1.AA4(DDR0_DQS0N) ; off-sheet DDR0_DQS0_N
DDR0_DQS0_P: U1.Y4(DDR0_DQS0P) ; off-sheet DDR0_DQS0_P
DDR0_DQS1_N: U1.AD4(DDR0_DQS1N) ; off-sheet DDR0_DQS1_N
DDR0_DQS1_P: U1.AC4(DDR0_DQS1P) ; off-sheet DDR0_DQS1_P
DDR0_DQS2_N: U1.V4(DDR0_DQS2N) ; off-sheet DDR0_DQS2_N
DDR0_DQS2_P: U1.U4(DDR0_DQS2P) ; off-sheet DDR0_DQS2_P
DDR0_DQS3_N: U1.R4(DDR0_DQS3N) ; off-sheet DDR0_DQS3_N
DDR0_DQS3_P: U1.P4(DDR0_DQS3P) ; off-sheet DDR0_DQS3_P
DDR0_RST: U1.L7(DDR0_RESET) ; off-sheet DDR0_RST
DDR1_A0: U1.B10(DDR1_A0) ; off-sheet DDR1_A0
DDR1_A1: U1.A10(DDR1_A1) ; off-sheet DDR1_A1
DDR1_A2: U1.B9(DDR1_A2) ; off-sheet DDR1_A2
DDR1_A3: U1.A9(DDR1_A3) ; off-sheet DDR1_A3
DDR1_A4: U1.B8(DDR1_A4) ; off-sheet DDR1_A4
DDR1_A5: U1.A8(DDR1_A5) ; off-sheet DDR1_A5
DDR1_CKE0: U1.A5(DDR1_CKE0) ; off-sheet DDR1_CKE0
DDR1_CKE1: U1.E6(DDR1_CKE1) ; off-sheet DDR1_CKE1
DDR1_CLK1_N: U1.E8(DDR1_CLK1N) ; off-sheet DDR1_CLK1_N
DDR1_CLK1_P: U1.E9(DDR1_CLK1P) ; off-sheet DDR1_CLK1_P
DDR1_CLK_N: U1.D8(DDR1_CLK0N) ; off-sheet DDR1_CLK_N
DDR1_CLK_P: U1.D9(DDR1_CLK0P) ; off-sheet DDR1_CLK_P
DDR1_CS0N: U1.F12(DDR1_CSn0) ; off-sheet DDR1_CS0N
DDR1_CS1N: U1.A2(DDR1_CSn1) ; off-sheet DDR1_CS1N
DDR1_CS2N: U1.F11(DDR1_CSn2) ; off-sheet DDR1_CS2N
DDR1_CS3N: U1.B3(DDR1_CSn3) ; off-sheet DDR1_CS3N
DDR1_D0: U1.B15(DDR1_DQ0) ; off-sheet DDR1_D0
DDR1_D1: U1.A15(DDR1_DQ1) ; off-sheet DDR1_D1
DDR1_D2: U1.B16(DDR1_DQ2) ; off-sheet DDR1_D2
DDR1_D3: U1.A16(DDR1_DQ3) ; off-sheet DDR1_D3
DDR1_D4: U1.B17(DDR1_DQ4) ; off-sheet DDR1_D4
DDR1_D5: U1.A17(DDR1_DQ5) ; off-sheet DDR1_D5
DDR1_D6: U1.A18(DDR1_DQ6) ; off-sheet DDR1_D6
DDR1_D7: U1.B18(DDR1_DQ7) ; off-sheet DDR1_D7
DDR1_D8: U1.B11(DDR1_DQ8) ; off-sheet DDR1_D8
DDR1_D9: U1.B12(DDR1_DQ9) ; off-sheet DDR1_D9
DDR1_D10: U1.A11(DDR1_DQ10) ; off-sheet DDR1_D10
DDR1_D11: U1.B13(DDR1_DQ11) ; off-sheet DDR1_D11
DDR1_D12: U1.A12(DDR1_DQ12) ; off-sheet DDR1_D12
DDR1_D13: U1.A13(DDR1_DQ13) ; off-sheet DDR1_D13
DDR1_D14: U1.A14(DDR1_DQ14) ; off-sheet DDR1_D14
DDR1_D15: U1.B14(DDR1_DQ15) ; off-sheet DDR1_D15
DDR1_D16: U1.A19(DDR1_DQ16) ; off-sheet DDR1_D16
DDR1_D17: U1.B19(DDR1_DQ17) ; off-sheet DDR1_D17
DDR1_D18: U1.A20(DDR1_DQ18) ; off-sheet DDR1_D18
DDR1_D19: U1.B20(DDR1_DQ19) ; off-sheet DDR1_D19
DDR1_D20: U1.A21(DDR1_DQ20) ; off-sheet DDR1_D20
DDR1_D21: U1.B21(DDR1_DQ21) ; off-sheet DDR1_D21
DDR1_D22: U1.B22(DDR1_DQ22) ; off-sheet DDR1_D22
DDR1_D23: U1.A22(DDR1_DQ23) ; off-sheet DDR1_D23
DDR1_D24: U1.A23(DDR1_DQ24) ; off-sheet DDR1_D24
DDR1_D25: U1.B23(DDR1_DQ25) ; off-sheet DDR1_D25
DDR1_D26: U1.A24(DDR1_DQ26) ; off-sheet DDR1_D26
DDR1_D27: U1.A25(DDR1_DQ27) ; off-sheet DDR1_D27
DDR1_D28: U1.B24(DDR1_DQ28) ; off-sheet DDR1_D28
DDR1_D29: U1.A26(DDR1_DQ29) ; off-sheet DDR1_D29
DDR1_D30: U1.B25(DDR1_DQ30) ; off-sheet DDR1_D30
DDR1_D31: U1.B26(DDR1_DQ31) ; off-sheet DDR1_D31
DDR1_DM0: U1.E17(DDR1_DM0) ; off-sheet DDR1_DM0
DDR1_DM1: U1.E14(DDR1_DM1) ; off-sheet DDR1_DM1
DDR1_DM2: U1.E20(DDR1_DM2) ; off-sheet DDR1_DM2
DDR1_DM3: U1.E23(DDR1_DM3) ; off-sheet DDR1_DM3
DDR1_DQS0_N: U1.D17(DDR1_DQS0N) ; off-sheet DDR1_DQS0_N
DDR1_DQS0_P: U1.D18(DDR1_DQS0P) ; off-sheet DDR1_DQS0_P
DDR1_DQS1_N: U1.D14(DDR1_DQS1N) ; off-sheet DDR1_DQS1_N
DDR1_DQS1_P: U1.D15(DDR1_DQS1P) ; off-sheet DDR1_DQS1_P
DDR1_DQS2_N: U1.D20(DDR1_DQS2N) ; off-sheet DDR1_DQS2_N
DDR1_DQS2_P: U1.D21(DDR1_DQS2P) ; off-sheet DDR1_DQS2_P
DDR1_DQS3_N: U1.D23(DDR1_DQS3N) ; off-sheet DDR1_DQS3_N
DDR1_DQS3_P: U1.D24(DDR1_DQS3P) ; off-sheet DDR1_DQS3_P
DDR1_RST: U1.G11(DDR1_RESET) ; off-sheet DDR1_RST
NetFB4_1: FB4.1 U1.R8(DDR0PLL_AVDD_0V9)
NetFB5_1: FB5.1 U1.H14(DDR1PLL_AVDD_0V9)
NetFB6_1: FB6.1 U1.M7(DDR0_CLK_VDD)
NetFB7_1: FB7.1 U1.G12(DDR1_CLK_VDD)
NetR4_2: R4.2 U1.R7(DDR0_PZQ)
NetR5_2: R5.2 U1.G15(DDR1_PZQ)

Not connected (* = marked no-connect by the designer): U1 A3(DDR1_A12)* A4(DDR1_A10)* A6(DDR1_A9)* A7(DDR1_A7)* B2(DDR1_BA0)* B4(DDR1_A13)* B6(DDR1_A8)* B7(DDR1_A6)* C1(DDR0_A12)* C3(DDR0_BA0)* C4(DDR1_A14)* C5(DDR1_A11)* C6(DDR1_RASn)* D1(DDR0_A10)* D2(DDR0_A13)* D3(DDR0_A14)* D6(DDR1_BA1)* D11(DDR1_ODT0)* D12(DDR1_BA2)* E3(DDR0_A11)* E11(DDR1_ODT1)* F3(DDR0_RASn)* F4(DDR0_BA1)* F7(DDR1_WEn)* F9(DDR1_CASn)* F14(DDR1_PLL_TESTOUT_P)* F17(DDR1_ATB0)* G6(DDR0_WEn)* G8(DDR1_A15)* G14(DDR1_PLL_TESTOUT_N)* G17(DDR1_ATB1)* H6(DDR0_CASn)* H7(DDR0_A15)* J1(DDR0_A6)* J2(DDR0_A7)* K1(DDR0_A9)* K2(DDR0_A8)* L4(DDR0_ODT0)* L5(DDR0_ODT1)* M4(DDR0_BA2)* U6(DDR0_ATB0)* U7(DDR0_ATB1)* V6(DDR0_PLL_TESTOUT_P)* V7(DDR0_PLL_TESTOUT_N)*

### Layout directives
net class 50OHM_DDR_D: DDR0_D0, DDR0_D1, DDR0_D2, DDR0_D3, DDR0_D4, DDR0_D5, DDR0_D6, DDR0_D7, DDR0_D8, DDR0_D9, DDR0_D10, DDR0_D11, DDR0_D12, DDR0_D13, DDR0_D14, DDR0_D15, DDR0_D16, DDR0_D17, DDR0_D18, DDR0_D19, DDR0_D20, DDR0_D21, DDR0_D22, DDR0_D23, DDR0_D24, DDR0_D25, DDR0_D26, DDR0_D27, DDR0_D28, DDR0_D29, DDR0_D30, DDR0_D31, DDR0_DM0, DDR0_DM1, DDR0_DM2, DDR0_DM3, DDR1_D0, DDR1_D1, DDR1_D2, DDR1_D3, DDR1_D4, DDR1_D5, DDR1_D6, DDR1_D7, DDR1_D8, DDR1_D9, DDR1_D10, DDR1_D11, DDR1_D12, DDR1_D13, DDR1_D14, DDR1_D15, DDR1_D16, DDR1_D17, DDR1_D18, DDR1_D19, DDR1_D20, DDR1_D21, DDR1_D22, DDR1_D23, DDR1_D24, DDR1_D25, DDR1_D26, DDR1_D27, DDR1_D28, DDR1_D29, DDR1_D30, DDR1_D31, DDR1_DM0, DDR1_DM1, DDR1_DM2, DDR1_DM3
net class DDR_G-1: DDR0_D0, DDR0_D1, DDR0_D2, DDR0_D3, DDR0_D4, DDR0_D5, DDR0_D6, DDR0_D7, DDR0_DM0, DDR0_DQS0_N, DDR0_DQS0_P, DDR1_D0, DDR1_D1, DDR1_D2, DDR1_D3, DDR1_D4, DDR1_D5, DDR1_D6, DDR1_D7, DDR1_DM0, DDR1_DQS0_N, DDR1_DQS0_P
net class DDR_G-2: DDR0_D8, DDR0_D9, DDR0_D10, DDR0_D11, DDR0_D12, DDR0_D13, DDR0_D14, DDR0_D15, DDR0_DM1, DDR0_DQS1_N, DDR0_DQS1_P, DDR1_D8, DDR1_D9, DDR1_D10, DDR1_D11, DDR1_D12, DDR1_D13, DDR1_D14, DDR1_D15, DDR1_DM1, DDR1_DQS1_N, DDR1_DQS1_P
net class DDR_G-3: DDR0_D16, DDR0_D17, DDR0_D18, DDR0_D19, DDR0_D20, DDR0_D21, DDR0_D22, DDR0_D23, DDR0_DM2, DDR0_DQS2_N, DDR0_DQS2_P, DDR1_D16, DDR1_D17, DDR1_D18, DDR1_D19, DDR1_D20, DDR1_D21, DDR1_D22, DDR1_D23, DDR1_DM2, DDR1_DQS2_N, DDR1_DQS2_P
net class DDR_G-4: DDR0_D24, DDR0_D25, DDR0_D26, DDR0_D27, DDR0_D28, DDR0_D29, DDR0_D30, DDR0_D31, DDR0_DM3, DDR0_DQS3_N, DDR0_DQS3_P, DDR1_D24, DDR1_D25, DDR1_D26, DDR1_D27, DDR1_D28, DDR1_D29, DDR1_D30, DDR1_D31, DDR1_DM3, DDR1_DQS3_N, DDR1_DQS3_P
differential pair; differential pair class DIFF100_DDR_DQS: DDR0_DQS0_N, DDR0_DQS0_P, DDR0_DQS1_N, DDR0_DQS1_P, DDR0_DQS2_N, DDR0_DQS2_P, DDR0_DQS3_N, DDR0_DQS3_P, DDR1_DQS0_N, DDR1_DQS0_P, DDR1_DQS1_N, DDR1_DQS1_P, DDR1_DQS2_N, DDR1_DQS2_P, DDR1_DQS3_N, DDR1_DQS3_P
net class 50OHM_DDR_A: DDR0_A0, DDR0_A1, DDR0_A2, DDR0_A3, DDR0_A4, DDR0_A5, DDR1_A0, DDR1_A1, DDR1_A2, DDR1_A3, DDR1_A4, DDR1_A5
differential pair; differential pair class DIFF100_DDR_CLK: DDR0_CLK1_N, DDR0_CLK1_P, DDR0_CLK_N, DDR0_CLK_P, DDR1_CLK1_N, DDR1_CLK1_P, DDR1_CLK_N, DDR1_CLK_P
net class 50OHM_DDR_CTRL: DDR0_CKE0, DDR0_CKE1, DDR0_CS0N, DDR0_CS1N, DDR0_CS2N, DDR0_CS3N, DDR1_CKE0, DDR1_CKE1, DDR1_CS0N, DDR1_CS1N, DDR1_CS2N, DDR1_CS3N
net class DIFF_PAIR_CLASS: DDR0_CLK1_N, DDR0_CLK1_P, DDR0_CLK_N, DDR0_CLK_P, DDR0_DQS0_N, DDR0_DQS0_P, DDR0_DQS1_N, DDR0_DQS1_P, DDR0_DQS2_N, DDR0_DQS2_P, DDR0_DQS3_N, DDR0_DQS3_P, DDR1_CLK1_N, DDR1_CLK1_P, DDR1_CLK_N, DDR1_CLK_P, DDR1_DQS0_N, DDR1_DQS0_P, DDR1_DQS1_N, DDR1_DQS1_P, DDR1_DQS2_N, DDR1_DQS2_P, DDR1_DQS3_N, DDR1_DQS3_P

### Notes on the sheet
- (near U1) DDR_G-2
- THIS DOCUMENT AND THE DATA DISCLOSED HEREIN OR
- HEREWITH IS THE PROPERTY OF ALTIUM LIMITED AND MAY
- DWG NO:
- REVISION
- REV:
- DESCRIPTION
- DATE
- APPROVED
- BE FREELY DISTRIBUTED IN WHOLE. NO RIGHTS ARE
- RESERVED OR EXPRESS OR IMPLIED WARANTEE GIVEN.
- ENG:
- APPROVALS
- PROJECT
- DSN:
- CHK:
- REFERENCE DOCUMENTS
- PROJECT REVISION:
- TITLE
- DOCUMENT REVISION:
- DESIGN ITEM:
- BOM:
- FAB DWG:
- PCB DWG:
- ASSY DWG:
- SCALE:
- A3
- SIZE
- CAGE CODE
- FILE NAME
- DWG NO.
- SHEET
- OF
- REV

### Library data of the parts
C64 C74 = CAP_22uF-6.3V-20%-0402: as C5 on sheet Power Supply Page for RK3399; Case/Package: 0402; Supplier-1: Digikey
C65 C75 = CAP_10uF-10V-20%-0402: as C1 on sheet Power Supply Page for RK3399; Case/Package: 0402; Supplier-1: Digikey
C66 C76 = CAP_1uF-16V-10%-0201: as C7 on sheet Power Supply Page for RK3399; Case/Package: 0201; Supplier-1: Digikey
C67-C73 C77-C81 = CAP_100nF-25V-10%-0201: as C8 on sheet Power Supply Page for RK3399; Case/Package: 0201; Supplier-1: Digikey
FB4-FB7 = FB_120R-1.3A-100Mhz-0402: as FB1 on sheet System PMU for RK3399; Mnaufacturer Part Number: BLM15PD121SN1D; Case/Package: 0402; Supplier-1: Digikey
R4 R5 = RES_240R-0.05W-1%-0201: 240 Ohms ±1% 0.05W, 1/20W Chip Resistor 0201 (0603 Metric) Thick Film /; Manufacturer: Yageo; Manufacturer Part Number: RC0201FR-07240RL; Case/Package: 0201; Supplier-1: Digikey
U1 = IC_RK3399-FCBGA828: as U1 on sheet Power Supply Page for RK3399; Manufacturer Part Number: RK3399; Case/Package: FCBGA828; Supplier-1: Rockchip

## Sheet LPDDR4 SDRAM_1.SchDoc: RK3399 COB Design V1.0
size A3; Author: ABC; Organization: Altium Limited; Address1: L3, 12a Rodborough Rd; Address2: Frenchs Forest; Address3: NSW; Address4: Australia 2086; DocumentNumber: 5; SheetNumber: 5; SheetTotal: 27; PROJECT CODE: A_V1.0
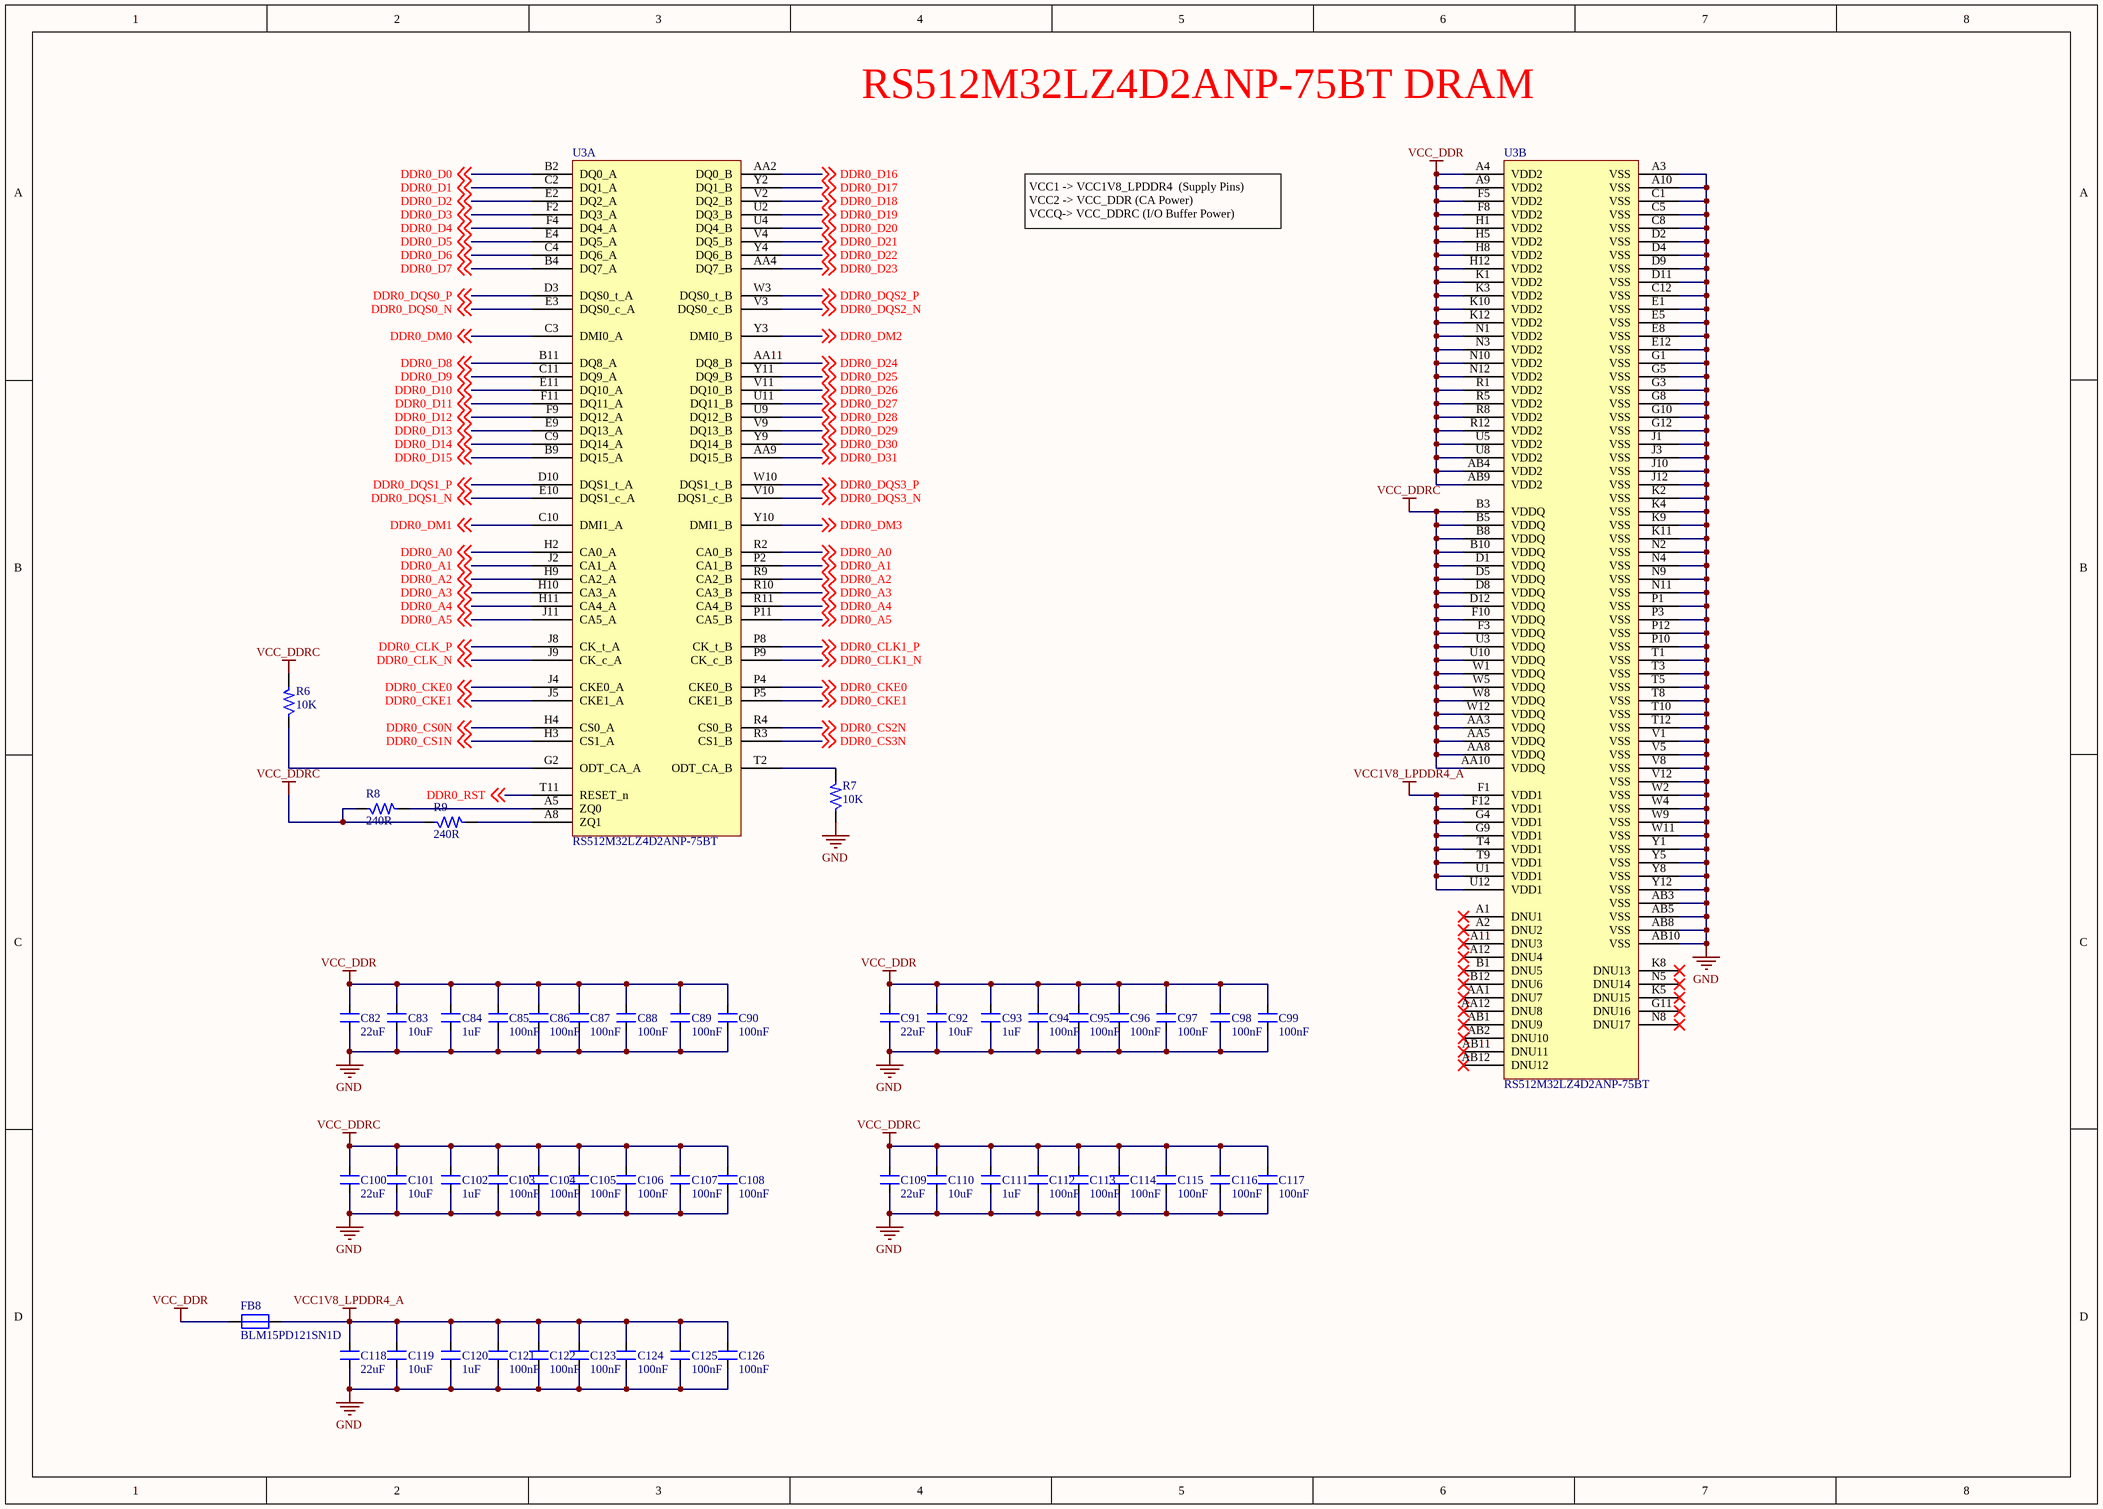
[diagram p4: LPDDR4 SDRAM_1.SchDoc]

### Parts
C82  22uF  [CAP_0402]
C83  10uF  [CAP_0402]
C84  1uF  [CAP_0201]
C85  100nF  [CAP_0201]
C86  100nF  [CAP_0201]
C87  100nF  [CAP_0201]
C88  100nF  [CAP_0201]
C89  100nF  [CAP_0201]
C90  100nF  [CAP_0201]
C91  22uF  [CAP_0402]
C92  10uF  [CAP_0402]
C93  1uF  [CAP_0201]
C94  100nF  [CAP_0201]
C95  100nF  [CAP_0201]
C96  100nF  [CAP_0201]
C97  100nF  [CAP_0201]
C98  100nF  [CAP_0201]
C99  100nF  [CAP_0201]
C100  22uF  [CAP_0402]
C101  10uF  [CAP_0402]
C102  1uF  [CAP_0201]
C103  100nF  [CAP_0201]
C104  100nF  [CAP_0201]
C105  100nF  [CAP_0201]
C106  100nF  [CAP_0201]
C107  100nF  [CAP_0201]
C108  100nF  [CAP_0201]
C109  22uF  [CAP_0402]
C110  10uF  [CAP_0402]
C111  1uF  [CAP_0201]
C112  100nF  [CAP_0201]
C113  100nF  [CAP_0201]
C114  100nF  [CAP_0201]
C115  100nF  [CAP_0201]
C116  100nF  [CAP_0201]
C117  100nF  [CAP_0201]
C118  22uF  [CAP_0402]
C119  10uF  [CAP_0402]
C120  1uF  [CAP_0201]
C121  100nF  [CAP_0201]
C122  100nF  [CAP_0201]
C123  100nF  [CAP_0201]
C124  100nF  [CAP_0201]
C125  100nF  [CAP_0201]
C126  100nF  [CAP_0201]
FB8  BLM15PD121SN1D  [RES_0402]
R6  10K  [RES_0201]
R7  10K  [RES_0201]
R8  240R  [RES_0201]
R9  240R  [RES_0201]
U3  RS512M32LZ4D2ANP-75BT  [FBGA200_SMD]  (parts A,B of 2)

### Nets
GND: C82.1 C83.1 C84.1 C85.1 C86.1 C87.1 C88.1 C89.1 C90.1 C91.1 C92.1 C93.1 C94.1 C95.1 C96.1 C97.1 C98.1 C99.1 C100.1 C101.1 C102.1 C103.1 C104.1 C105.1 C106.1 C107.1 C108.1 C109.1 C110.1 C111.1 C112.1 C113.1 C114.1 C115.1 C116.1 C117.1 C118.1 C119.1 C120.1 C121.1 C122.1 C123.1 C124.1 C125.1 C126.1 R7.1 U3.A3(VSS) U3.A10(VSS) U3.AB3(VSS) U3.AB5(VSS) U3.AB8(VSS) U3.AB10(VSS) U3.C1(VSS) U3.C5(VSS) U3.C8(VSS) U3.C12(VSS) U3.D2(VSS) U3.D4(VSS) U3.D9(VSS) U3.D11(VSS) U3.E1(VSS) U3.E5(VSS) U3.E8(VSS) U3.E12(VSS) U3.G1(VSS) U3.G3(VSS) U3.G5(VSS) U3.G8(VSS) U3.G10(VSS) U3.G12(VSS) U3.J1(VSS) U3.J3(VSS) U3.J10(VSS) U3.J12(VSS) U3.K2(VSS) U3.K4(VSS) U3.K9(VSS) U3.K11(VSS) U3.N2(VSS) U3.N4(VSS) U3.N9(VSS) U3.N11(VSS) U3.P1(VSS) U3.P3(VSS) U3.P10(VSS) U3.P12(VSS) U3.T1(VSS) U3.T3(VSS) U3.T5(VSS) U3.T8(VSS) U3.T10(VSS) U3.T12(VSS) U3.V1(VSS) U3.V5(VSS) U3.V8(VSS) U3.V12(VSS) U3.W2(VSS) U3.W4(VSS) U3.W9(VSS) U3.W11(VSS) U3.Y1(VSS) U3.Y5(VSS) U3.Y8(VSS) U3.Y12(VSS)
VCC1V8_LPDDR4_A: C118.2 C119.2 C120.2 C121.2 C122.2 C123.2 C124.2 C125.2 C126.2 FB8.2 U3.F1(VDD1) U3.F12(VDD1) U3.G4(VDD1) U3.G9(VDD1) U3.T4(VDD1) U3.T9(VDD1) U3.U1(VDD1) U3.U12(VDD1)
VCC_DDR: C82.2 C83.2 C84.2 C85.2 C86.2 C87.2 C88.2 C89.2 C90.2 C91.2 C92.2 C93.2 C94.2 C95.2 C96.2 C97.2 C98.2 C99.2 FB8.1 U3.A4(VDD2) U3.A9(VDD2) U3.AB4(VDD2) U3.AB9(VDD2) U3.F5(VDD2) U3.F8(VDD2) U3.H1(VDD2) U3.H5(VDD2) U3.H8(VDD2) U3.H12(VDD2) U3.K1(VDD2) U3.K3(VDD2) U3.K10(VDD2) U3.K12(VDD2) U3.N1(VDD2) U3.N3(VDD2) U3.N10(VDD2) U3.N12(VDD2) U3.R1(VDD2) U3.R5(VDD2) U3.R8(VDD2) U3.R12(VDD2) U3.U5(VDD2) U3.U8(VDD2)
VCC_DDRC: C100.2 C101.2 C102.2 C103.2 C104.2 C105.2 C106.2 C107.2 C108.2 C109.2 C110.2 C111.2 C112.2 C113.2 C114.2 C115.2 C116.2 C117.2 R6.2 R8.1 R9.1 U3.AA3(VDDQ) U3.AA5(VDDQ) U3.AA8(VDDQ) U3.AA10(VDDQ) U3.B3(VDDQ) U3.B5(VDDQ) U3.B8(VDDQ) U3.B10(VDDQ) U3.D1(VDDQ) U3.D5(VDDQ) U3.D8(VDDQ) U3.D12(VDDQ) U3.F3(VDDQ) U3.F10(VDDQ) U3.U3(VDDQ) U3.U10(VDDQ) U3.W1(VDDQ) U3.W5(VDDQ) U3.W8(VDDQ) U3.W12(VDDQ)
DDR0_A0: U3.H2(CA0_A) U3.R2(CA0_B) ; off-sheet DDR0_A0
DDR0_A1: U3.J2(CA1_A) U3.P2(CA1_B) ; off-sheet DDR0_A1
DDR0_A2: U3.H9(CA2_A) U3.R9(CA2_B) ; off-sheet DDR0_A2
DDR0_A3: U3.H10(CA3_A) U3.R10(CA3_B) ; off-sheet DDR0_A3
DDR0_A4: U3.H11(CA4_A) U3.R11(CA4_B) ; off-sheet DDR0_A4
DDR0_A5: U3.J11(CA5_A) U3.P11(CA5_B) ; off-sheet DDR0_A5
DDR0_CKE0: U3.J4(CKE0_A) U3.P4(CKE0_B) ; off-sheet DDR0_CKE0
DDR0_CKE1: U3.J5(CKE1_A) U3.P5(CKE1_B) ; off-sheet DDR0_CKE1
DDR0_CLK1_N: U3.P9(CK_c_B) ; off-sheet DDR0_CLK1_N
DDR0_CLK1_P: U3.P8(CK_t_B) ; off-sheet DDR0_CLK1_P
DDR0_CLK_N: U3.J9(CK_c_A) ; off-sheet DDR0_CLK_N
DDR0_CLK_P: U3.J8(CK_t_A) ; off-sheet DDR0_CLK_P
DDR0_CS0N: U3.H4(CS0_A) ; off-sheet DDR0_CS0N
DDR0_CS1N: U3.H3(CS1_A) ; off-sheet DDR0_CS1N
DDR0_CS2N: U3.R4(CS0_B) ; off-sheet DDR0_CS2N
DDR0_CS3N: U3.R3(CS1_B) ; off-sheet DDR0_CS3N
DDR0_D0: U3.B2(DQ0_A) ; off-sheet DDR0_D0
DDR0_D1: U3.C2(DQ1_A) ; off-sheet DDR0_D1
DDR0_D2: U3.E2(DQ2_A) ; off-sheet DDR0_D2
DDR0_D3: U3.F2(DQ3_A) ; off-sheet DDR0_D3
DDR0_D4: U3.F4(DQ4_A) ; off-sheet DDR0_D4
DDR0_D5: U3.E4(DQ5_A) ; off-sheet DDR0_D5
DDR0_D6: U3.C4(DQ6_A) ; off-sheet DDR0_D6
DDR0_D7: U3.B4(DQ7_A) ; off-sheet DDR0_D7
DDR0_D8: U3.B11(DQ8_A) ; off-sheet DDR0_D8
DDR0_D9: U3.C11(DQ9_A) ; off-sheet DDR0_D9
DDR0_D10: U3.E11(DQ10_A) ; off-sheet DDR0_D10
DDR0_D11: U3.F11(DQ11_A) ; off-sheet DDR0_D11
DDR0_D12: U3.F9(DQ12_A) ; off-sheet DDR0_D12
DDR0_D13: U3.E9(DQ13_A) ; off-sheet DDR0_D13
DDR0_D14: U3.C9(DQ14_A) ; off-sheet DDR0_D14
DDR0_D15: U3.B9(DQ15_A) ; off-sheet DDR0_D15
DDR0_D16: U3.AA2(DQ0_B) ; off-sheet DDR0_D16
DDR0_D17: U3.Y2(DQ1_B) ; off-sheet DDR0_D17
DDR0_D18: U3.V2(DQ2_B) ; off-sheet DDR0_D18
DDR0_D19: U3.U2(DQ3_B) ; off-sheet DDR0_D19
DDR0_D20: U3.U4(DQ4_B) ; off-sheet DDR0_D20
DDR0_D21: U3.V4(DQ5_B) ; off-sheet DDR0_D21
DDR0_D22: U3.Y4(DQ6_B) ; off-sheet DDR0_D22
DDR0_D23: U3.AA4(DQ7_B) ; off-sheet DDR0_D23
DDR0_D24: U3.AA11(DQ8_B) ; off-sheet DDR0_D24
DDR0_D25: U3.Y11(DQ9_B) ; off-sheet DDR0_D25
DDR0_D26: U3.V11(DQ10_B) ; off-sheet DDR0_D26
DDR0_D27: U3.U11(DQ11_B) ; off-sheet DDR0_D27
DDR0_D28: U3.U9(DQ12_B) ; off-sheet DDR0_D28
DDR0_D29: U3.V9(DQ13_B) ; off-sheet DDR0_D29
DDR0_D30: U3.Y9(DQ14_B) ; off-sheet DDR0_D30
DDR0_D31: U3.AA9(DQ15_B) ; off-sheet DDR0_D31
DDR0_DM0: U3.C3(DMI0_A) ; off-sheet DDR0_DM0
DDR0_DM1: U3.C10(DMI1_A) ; off-sheet DDR0_DM1
DDR0_DM2: U3.Y3(DMI0_B) ; off-sheet DDR0_DM2
DDR0_DM3: U3.Y10(DMI1_B) ; off-sheet DDR0_DM3
DDR0_DQS0_N: U3.E3(DQS0_c_A) ; off-sheet DDR0_DQS0_N
DDR0_DQS0_P: U3.D3(DQS0_t_A) ; off-sheet DDR0_DQS0_P
DDR0_DQS1_N: U3.E10(DQS1_c_A) ; off-sheet DDR0_DQS1_N
DDR0_DQS1_P: U3.D10(DQS1_t_A) ; off-sheet DDR0_DQS1_P
DDR0_DQS2_N: U3.V3(DQS0_c_B) ; off-sheet DDR0_DQS2_N
DDR0_DQS2_P: U3.W3(DQS0_t_B) ; off-sheet DDR0_DQS2_P
DDR0_DQS3_N: U3.V10(DQS1_c_B) ; off-sheet DDR0_DQS3_N
DDR0_DQS3_P: U3.W10(DQS1_t_B) ; off-sheet DDR0_DQS3_P
DDR0_RST: U3.T11(RESET_n) ; off-sheet DDR0_RST
NetR6_1: R6.1 U3.G2(ODT_CA_A)
NetR7_2: R7.2 U3.T2(ODT_CA_B)
NetR8_2: R8.2 U3.A5(ZQ0)
NetR9_2: R9.2 U3.A8(ZQ1)

Not connected (* = marked no-connect by the designer): U3 A1(DNU1)* A2(DNU2)* A11(DNU3)* A12(DNU4)* AA1(DNU7)* AA12(DNU8)* AB1(DNU9)* AB2(DNU10)* AB11(DNU11)* AB12(DNU12)* B1(DNU5)* B12(DNU6)* G11(DNU16)* K5(DNU15)* K8(DNU13)* N5(DNU14)* N8(DNU17)*

### Notes on the sheet
- RS512M32LZ4D2ANP-75BT DRAM
- VCC1 -> VCC1V8_LPDDR4  (Supply Pins)
  VCC2 -> VCC_DDR (CA Power)
  VCCQ-> VCC_DDRC (I/O Buffer Power)
- TITLE:
- DOCUMENT NAME:
- SCALE 1:1
- This document is copyright of Esteempcb and shall not be revealed, produced, copied, in whole or in part, nor
- PROJECT CODE:
- TEMPLATE:
- A3
- AUTHOR:
- Sheet
- of
- used for any purpose other than submitted.

### Library data of the parts
C82 C91 C100 C109 C118 = CAP_22uF-6.3V-20%-0402: as C5 on sheet Power Supply Page for RK3399; Case/Package: 0402; Supplier-1: Digikey
C83 C92 C101 C110 C119 = CAP_10uF-10V-20%-0402: as C1 on sheet Power Supply Page for RK3399; Case/Package: 0402; Supplier-1: Digikey
C84 C93 C102 C111 C120 = CAP_1uF-16V-10%-0201: as C7 on sheet Power Supply Page for RK3399; Case/Package: 0201; Supplier-1: Digikey
C85-C90 C94-C99 C103-C108 C112-C117 C121-C126 = CAP_100nF-25V-10%-0201: as C8 on sheet Power Supply Page for RK3399; Case/Package: 0201; Supplier-1: Digikey
FB8 = FB_120R-1.3A-100Mhz-0402: as FB1 on sheet System PMU for RK3399; Mnaufacturer Part Number: BLM15PD121SN1D; Case/Package: 0402; Supplier-1: Digikey
R6 R7 = RES_10K-0.05W-1%-0201: as R24 on sheet System PMU for RK3399; Case/Package: 0201; Supplier-1: Digikey
R8 R9 = RES_240R-0.05W-1%-0201: as R4 on sheet RK3399 Side of LPDDR4 Controller; Case/Package: 0201; Supplier-1: Digikey
U3 = IC_RS512M32LZ4D2ANP-75BT: LPDDR4/4X Package FBGA 200b Density 4Gbit~64Gbit Operating Temperature Range：-25~85℃ Speed：2667Mbps/3200Mbps/3733Mbps Voltage：VDD1/VDD2/VDDQ= 1.8 / 1.1 / 1.1 V（LPDDR4）VDD1/VDD2/VDDQ = 1.8 / 1.1 / 0.6 V（LPDDR4X）Approved Verification Platform：MTK、Spreadtrum; Manufacturer: RAYSON; Manufacturer Part Number: RS512M32LZ4D2ANP-75BT; Case/Package: FBGA 200b; Supplier-1: RAYSON

## Sheet LPDDR4 SDRAM_2.SchDoc: RK3399 COB Design V1.0
size A3; Author: ABC; Organization: Altium Limited; Address1: L3, 12a Rodborough Rd; Address2: Frenchs Forest; Address3: NSW; Address4: Australia 2086; DocumentNumber: 6; SheetNumber: 6; SheetTotal: 27; PROJECT CODE: A_V1.0
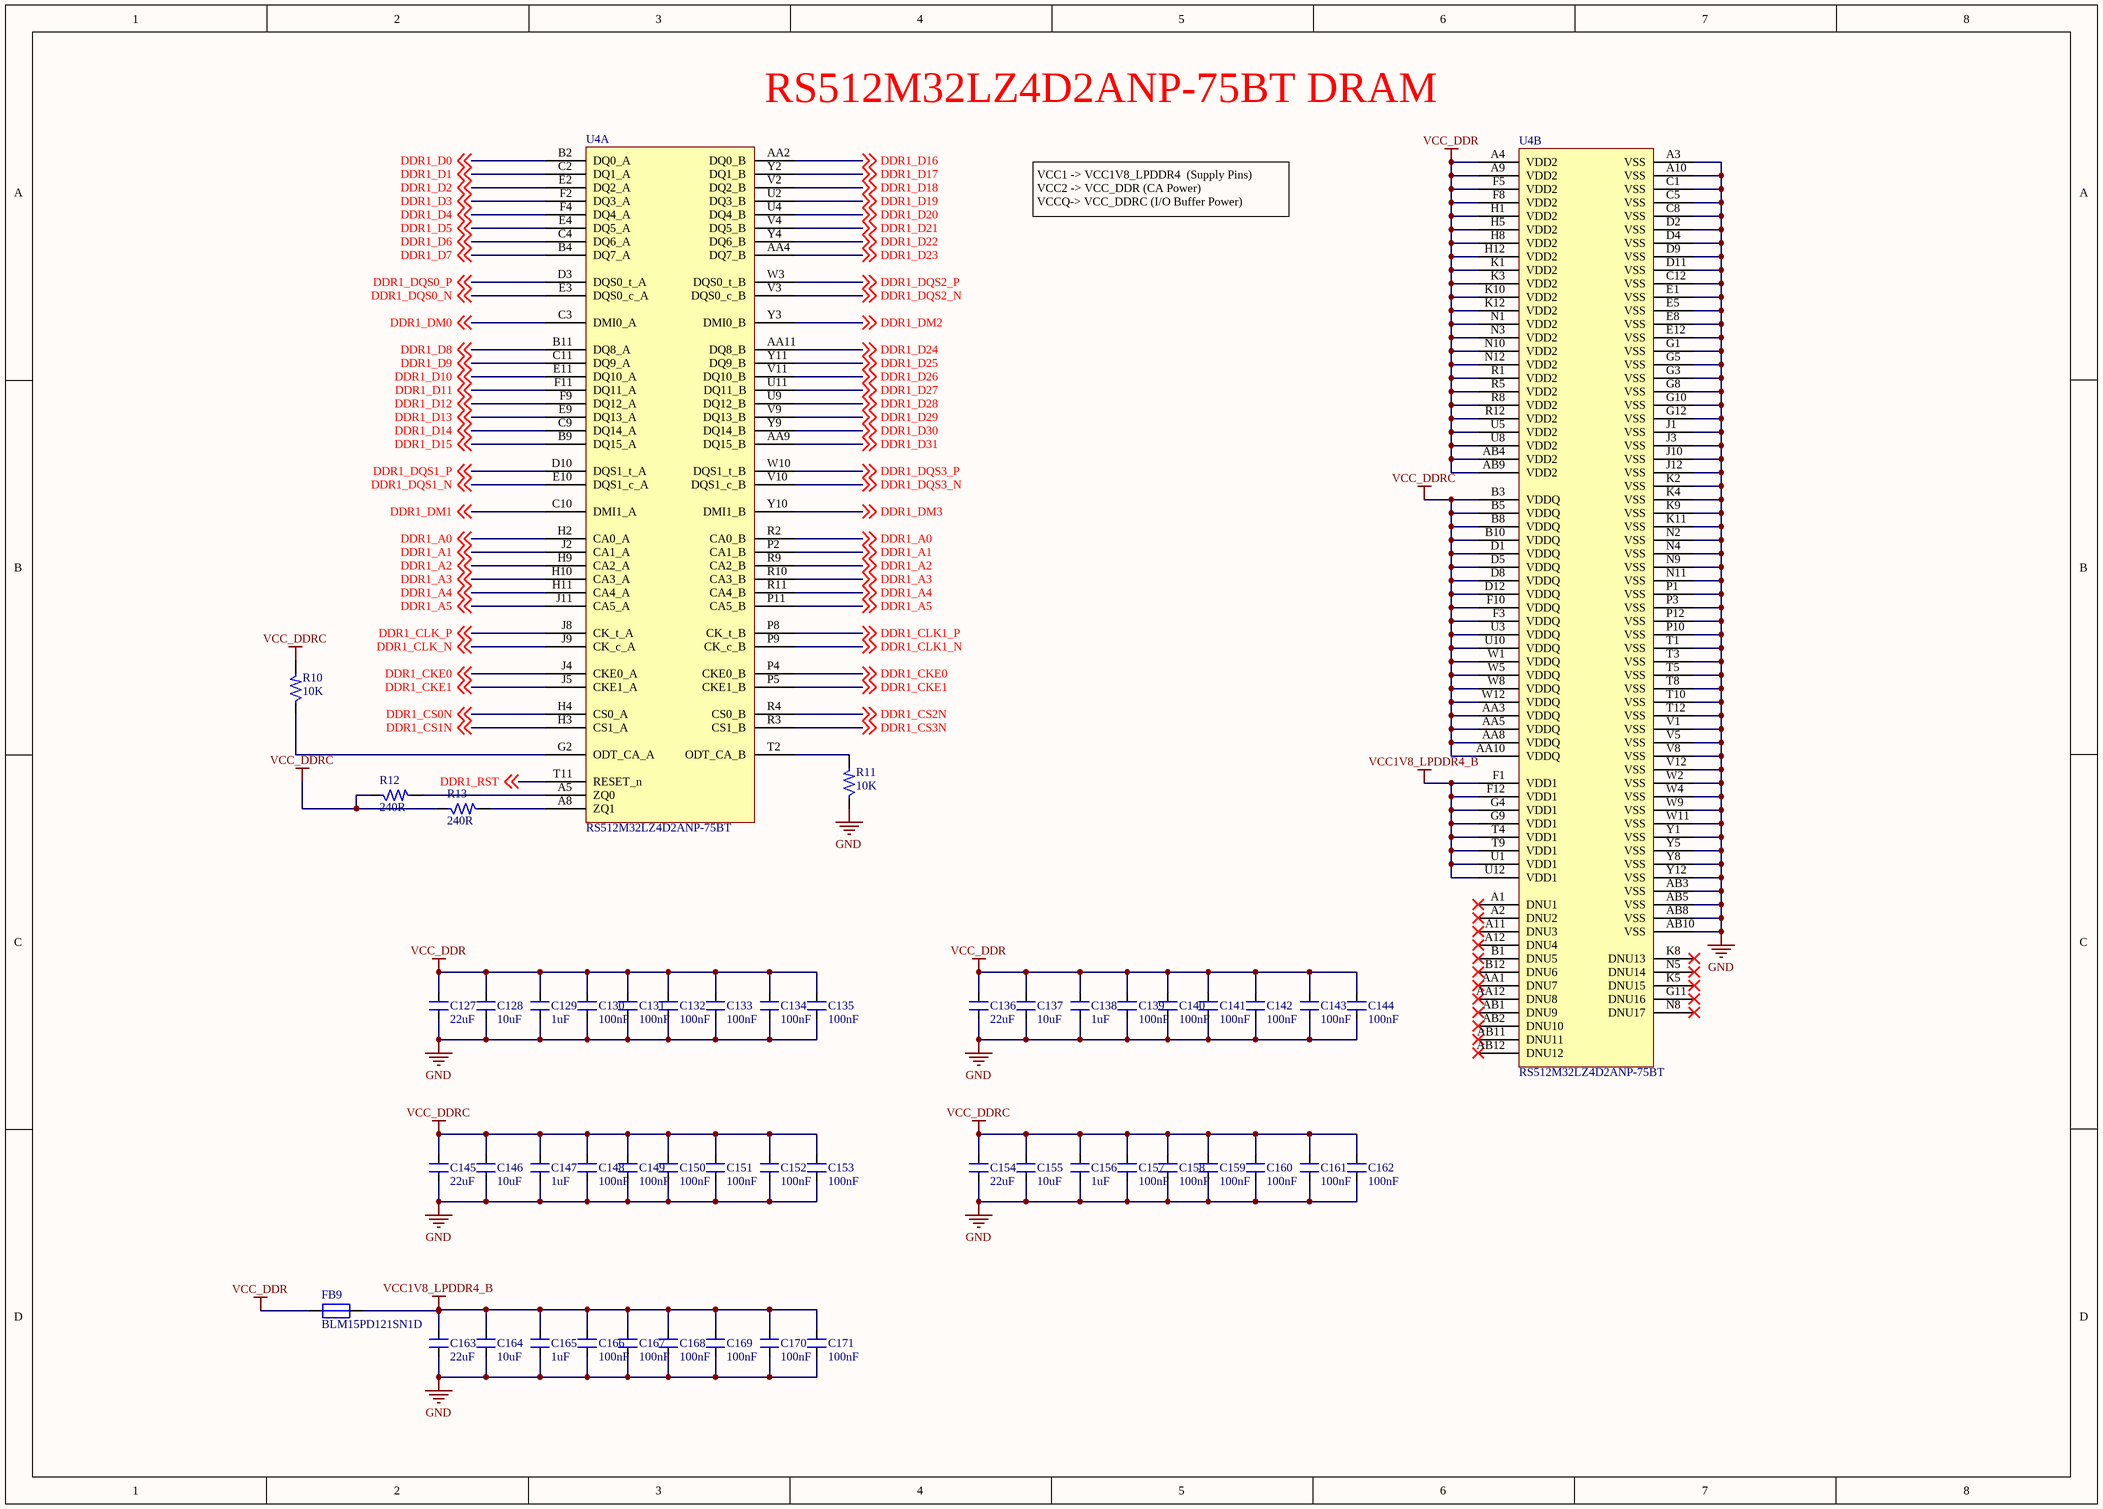
[diagram p5: LPDDR4 SDRAM_2.SchDoc]

### Parts
C127  22uF  [CAP_0402]
C128  10uF  [CAP_0402]
C129  1uF  [CAP_0201]
C130  100nF  [CAP_0201]
C131  100nF  [CAP_0201]
C132  100nF  [CAP_0201]
C133  100nF  [CAP_0201]
C134  100nF  [CAP_0201]
C135  100nF  [CAP_0201]
C136  22uF  [CAP_0402]
C137  10uF  [CAP_0402]
C138  1uF  [CAP_0201]
C139  100nF  [CAP_0201]
C140  100nF  [CAP_0201]
C141  100nF  [CAP_0201]
C142  100nF  [CAP_0201]
C143  100nF  [CAP_0201]
C144  100nF  [CAP_0201]
C145  22uF  [CAP_0402]
C146  10uF  [CAP_0402]
C147  1uF  [CAP_0201]
C148  100nF  [CAP_0201]
C149  100nF  [CAP_0201]
C150  100nF  [CAP_0201]
C151  100nF  [CAP_0201]
C152  100nF  [CAP_0201]
C153  100nF  [CAP_0201]
C154  22uF  [CAP_0402]
C155  10uF  [CAP_0402]
C156  1uF  [CAP_0201]
C157  100nF  [CAP_0201]
C158  100nF  [CAP_0201]
C159  100nF  [CAP_0201]
C160  100nF  [CAP_0201]
C161  100nF  [CAP_0201]
C162  100nF  [CAP_0201]
C163  22uF  [CAP_0402]
C164  10uF  [CAP_0402]
C165  1uF  [CAP_0201]
C166  100nF  [CAP_0201]
C167  100nF  [CAP_0201]
C168  100nF  [CAP_0201]
C169  100nF  [CAP_0201]
C170  100nF  [CAP_0201]
C171  100nF  [CAP_0201]
FB9  BLM15PD121SN1D  [RES_0402]
R10  10K  [RES_0201]
R11  10K  [RES_0201]
R12  240R  [RES_0201]
R13  240R  [RES_0201]
U4  RS512M32LZ4D2ANP-75BT  [FBGA200_SMD]  (parts A,B of 2)

### Nets
GND: C127.1 C128.1 C129.1 C130.1 C131.1 C132.1 C133.1 C134.1 C135.1 C136.1 C137.1 C138.1 C139.1 C140.1 C141.1 C142.1 C143.1 C144.1 C145.1 C146.1 C147.1 C148.1 C149.1 C150.1 C151.1 C152.1 C153.1 C154.1 C155.1 C156.1 C157.1 C158.1 C159.1 C160.1 C161.1 C162.1 C163.1 C164.1 C165.1 C166.1 C167.1 C168.1 C169.1 C170.1 C171.1 R11.1 U4.A3(VSS) U4.A10(VSS) U4.AB3(VSS) U4.AB5(VSS) U4.AB8(VSS) U4.AB10(VSS) U4.C1(VSS) U4.C5(VSS) U4.C8(VSS) U4.C12(VSS) U4.D2(VSS) U4.D4(VSS) U4.D9(VSS) U4.D11(VSS) U4.E1(VSS) U4.E5(VSS) U4.E8(VSS) U4.E12(VSS) U4.G1(VSS) U4.G3(VSS) U4.G5(VSS) U4.G8(VSS) U4.G10(VSS) U4.G12(VSS) U4.J1(VSS) U4.J3(VSS) U4.J10(VSS) U4.J12(VSS) U4.K2(VSS) U4.K4(VSS) U4.K9(VSS) U4.K11(VSS) U4.N2(VSS) U4.N4(VSS) U4.N9(VSS) U4.N11(VSS) U4.P1(VSS) U4.P3(VSS) U4.P10(VSS) U4.P12(VSS) U4.T1(VSS) U4.T3(VSS) U4.T5(VSS) U4.T8(VSS) U4.T10(VSS) U4.T12(VSS) U4.V1(VSS) U4.V5(VSS) U4.V8(VSS) U4.V12(VSS) U4.W2(VSS) U4.W4(VSS) U4.W9(VSS) U4.W11(VSS) U4.Y1(VSS) U4.Y5(VSS) U4.Y8(VSS) U4.Y12(VSS)
VCC1V8_LPDDR4_B: C163.2 C164.2 C165.2 C166.2 C167.2 C168.2 C169.2 C170.2 C171.2 FB9.2 U4.F1(VDD1) U4.F12(VDD1) U4.G4(VDD1) U4.G9(VDD1) U4.T4(VDD1) U4.T9(VDD1) U4.U1(VDD1) U4.U12(VDD1)
VCC_DDR: C127.2 C128.2 C129.2 C130.2 C131.2 C132.2 C133.2 C134.2 C135.2 C136.2 C137.2 C138.2 C139.2 C140.2 C141.2 C142.2 C143.2 C144.2 FB9.1 U4.A4(VDD2) U4.A9(VDD2) U4.AB4(VDD2) U4.AB9(VDD2) U4.F5(VDD2) U4.F8(VDD2) U4.H1(VDD2) U4.H5(VDD2) U4.H8(VDD2) U4.H12(VDD2) U4.K1(VDD2) U4.K3(VDD2) U4.K10(VDD2) U4.K12(VDD2) U4.N1(VDD2) U4.N3(VDD2) U4.N10(VDD2) U4.N12(VDD2) U4.R1(VDD2) U4.R5(VDD2) U4.R8(VDD2) U4.R12(VDD2) U4.U5(VDD2) U4.U8(VDD2)
VCC_DDRC: C145.2 C146.2 C147.2 C148.2 C149.2 C150.2 C151.2 C152.2 C153.2 C154.2 C155.2 C156.2 C157.2 C158.2 C159.2 C160.2 C161.2 C162.2 R10.2 R12.1 R13.1 U4.AA3(VDDQ) U4.AA5(VDDQ) U4.AA8(VDDQ) U4.AA10(VDDQ) U4.B3(VDDQ) U4.B5(VDDQ) U4.B8(VDDQ) U4.B10(VDDQ) U4.D1(VDDQ) U4.D5(VDDQ) U4.D8(VDDQ) U4.D12(VDDQ) U4.F3(VDDQ) U4.F10(VDDQ) U4.U3(VDDQ) U4.U10(VDDQ) U4.W1(VDDQ) U4.W5(VDDQ) U4.W8(VDDQ) U4.W12(VDDQ)
DDR1_A0: U4.H2(CA0_A) U4.R2(CA0_B) ; off-sheet DDR1_A0
DDR1_A1: U4.J2(CA1_A) U4.P2(CA1_B) ; off-sheet DDR1_A1
DDR1_A2: U4.H9(CA2_A) U4.R9(CA2_B) ; off-sheet DDR1_A2
DDR1_A3: U4.H10(CA3_A) U4.R10(CA3_B) ; off-sheet DDR1_A3
DDR1_A4: U4.H11(CA4_A) U4.R11(CA4_B) ; off-sheet DDR1_A4
DDR1_A5: U4.J11(CA5_A) U4.P11(CA5_B) ; off-sheet DDR1_A5
DDR1_CKE0: U4.J4(CKE0_A) U4.P4(CKE0_B) ; off-sheet DDR1_CKE0
DDR1_CKE1: U4.J5(CKE1_A) U4.P5(CKE1_B) ; off-sheet DDR1_CKE1
DDR1_CLK1_N: U4.P9(CK_c_B) ; off-sheet DDR1_CLK1_N
DDR1_CLK1_P: U4.P8(CK_t_B) ; off-sheet DDR1_CLK1_P
DDR1_CLK_N: U4.J9(CK_c_A) ; off-sheet DDR1_CLK_N
DDR1_CLK_P: U4.J8(CK_t_A) ; off-sheet DDR1_CLK_P
DDR1_CS0N: U4.H4(CS0_A) ; off-sheet DDR1_CS0N
DDR1_CS1N: U4.H3(CS1_A) ; off-sheet DDR1_CS1N
DDR1_CS2N: U4.R4(CS0_B) ; off-sheet DDR1_CS2N
DDR1_CS3N: U4.R3(CS1_B) ; off-sheet DDR1_CS3N
DDR1_D0: U4.B2(DQ0_A) ; off-sheet DDR1_D0
DDR1_D1: U4.C2(DQ1_A) ; off-sheet DDR1_D1
DDR1_D2: U4.E2(DQ2_A) ; off-sheet DDR1_D2
DDR1_D3: U4.F2(DQ3_A) ; off-sheet DDR1_D3
DDR1_D4: U4.F4(DQ4_A) ; off-sheet DDR1_D4
DDR1_D5: U4.E4(DQ5_A) ; off-sheet DDR1_D5
DDR1_D6: U4.C4(DQ6_A) ; off-sheet DDR1_D6
DDR1_D7: U4.B4(DQ7_A) ; off-sheet DDR1_D7
DDR1_D8: U4.B11(DQ8_A) ; off-sheet DDR1_D8
DDR1_D9: U4.C11(DQ9_A) ; off-sheet DDR1_D9
DDR1_D10: U4.E11(DQ10_A) ; off-sheet DDR1_D10
DDR1_D11: U4.F11(DQ11_A) ; off-sheet DDR1_D11
DDR1_D12: U4.F9(DQ12_A) ; off-sheet DDR1_D12
DDR1_D13: U4.E9(DQ13_A) ; off-sheet DDR1_D13
DDR1_D14: U4.C9(DQ14_A) ; off-sheet DDR1_D14
DDR1_D15: U4.B9(DQ15_A) ; off-sheet DDR1_D15
DDR1_D16: U4.AA2(DQ0_B) ; off-sheet DDR1_D16
DDR1_D17: U4.Y2(DQ1_B) ; off-sheet DDR1_D17
DDR1_D18: U4.V2(DQ2_B) ; off-sheet DDR1_D18
DDR1_D19: U4.U2(DQ3_B) ; off-sheet DDR1_D19
DDR1_D20: U4.U4(DQ4_B) ; off-sheet DDR1_D20
DDR1_D21: U4.V4(DQ5_B) ; off-sheet DDR1_D21
DDR1_D22: U4.Y4(DQ6_B) ; off-sheet DDR1_D22
DDR1_D23: U4.AA4(DQ7_B) ; off-sheet DDR1_D23
DDR1_D24: U4.AA11(DQ8_B) ; off-sheet DDR1_D24
DDR1_D25: U4.Y11(DQ9_B) ; off-sheet DDR1_D25
DDR1_D26: U4.V11(DQ10_B) ; off-sheet DDR1_D26
DDR1_D27: U4.U11(DQ11_B) ; off-sheet DDR1_D27
DDR1_D28: U4.U9(DQ12_B) ; off-sheet DDR1_D28
DDR1_D29: U4.V9(DQ13_B) ; off-sheet DDR1_D29
DDR1_D30: U4.Y9(DQ14_B) ; off-sheet DDR1_D30
DDR1_D31: U4.AA9(DQ15_B) ; off-sheet DDR1_D31
DDR1_DM0: U4.C3(DMI0_A) ; off-sheet DDR1_DM0
DDR1_DM1: U4.C10(DMI1_A) ; off-sheet DDR1_DM1
DDR1_DM2: U4.Y3(DMI0_B) ; off-sheet DDR1_DM2
DDR1_DM3: U4.Y10(DMI1_B) ; off-sheet DDR1_DM3
DDR1_DQS0_N: U4.E3(DQS0_c_A) ; off-sheet DDR1_DQS0_N
DDR1_DQS0_P: U4.D3(DQS0_t_A) ; off-sheet DDR1_DQS0_P
DDR1_DQS1_N: U4.E10(DQS1_c_A) ; off-sheet DDR1_DQS1_N
DDR1_DQS1_P: U4.D10(DQS1_t_A) ; off-sheet DDR1_DQS1_P
DDR1_DQS2_N: U4.V3(DQS0_c_B) ; off-sheet DDR1_DQS2_N
DDR1_DQS2_P: U4.W3(DQS0_t_B) ; off-sheet DDR1_DQS2_P
DDR1_DQS3_N: U4.V10(DQS1_c_B) ; off-sheet DDR1_DQS3_N
DDR1_DQS3_P: U4.W10(DQS1_t_B) ; off-sheet DDR1_DQS3_P
DDR1_RST: U4.T11(RESET_n) ; off-sheet DDR1_RST
NetR10_1: R10.1 U4.G2(ODT_CA_A)
NetR11_2: R11.2 U4.T2(ODT_CA_B)
NetR12_2: R12.2 U4.A5(ZQ0)
NetR13_2: R13.2 U4.A8(ZQ1)

Not connected (* = marked no-connect by the designer): U4 A1(DNU1)* A2(DNU2)* A11(DNU3)* A12(DNU4)* AA1(DNU7)* AA12(DNU8)* AB1(DNU9)* AB2(DNU10)* AB11(DNU11)* AB12(DNU12)* B1(DNU5)* B12(DNU6)* G11(DNU16)* K5(DNU15)* K8(DNU13)* N5(DNU14)* N8(DNU17)*

### Notes on the sheet
- (near U4) RS512M32LZ4D2ANP-75BT DRAM
- VCC1 -> VCC1V8_LPDDR4  (Supply Pins)
  VCC2 -> VCC_DDR (CA Power)
  VCCQ-> VCC_DDRC (I/O Buffer Power)
- TITLE:
- DOCUMENT NAME:
- SCALE 1:1
- This document is copyright of Esteempcb and shall not be revealed, produced, copied, in whole or in part, nor
- PROJECT CODE:
- TEMPLATE:
- A3
- AUTHOR:
- Sheet
- of
- used for any purpose other than submitted.

### Library data of the parts
C127 C136 C145 C154 C163 = CAP_22uF-6.3V-20%-0402: as C5 on sheet Power Supply Page for RK3399; Case/Package: 0402; Supplier-1: Digikey
C128 C137 C146 C155 C164 = CAP_10uF-10V-20%-0402: as C1 on sheet Power Supply Page for RK3399; Case/Package: 0402; Supplier-1: Digikey
C129 C138 C147 C156 C165 = CAP_1uF-16V-10%-0201: as C7 on sheet Power Supply Page for RK3399; Case/Package: 0201; Supplier-1: Digikey
C130-C135 C139-C144 C148-C153 C157-C162 C166-C171 = CAP_100nF-25V-10%-0201: as C8 on sheet Power Supply Page for RK3399; Case/Package: 0201; Supplier-1: Digikey
FB9 = FB_120R-1.3A-100Mhz-0402: as FB1 on sheet System PMU for RK3399; Mnaufacturer Part Number: BLM15PD121SN1D; Case/Package: 0402; Supplier-1: Digikey
R10 R11 = RES_10K-0.05W-1%-0201: as R24 on sheet System PMU for RK3399; Case/Package: 0201; Supplier-1: Digikey
R12 R13 = RES_240R-0.05W-1%-0201: as R4 on sheet RK3399 Side of LPDDR4 Controller; Case/Package: 0201; Supplier-1: Digikey
U4 = IC_RS512M32LZ4D2ANP-75BT: as U3 on sheet LPDDR4 SDRAM_1; Manufacturer Part Number: RS512M32LZ4D2ANP-75BT; Case/Package: FBGA 200b; Supplier-1: RAYSON